# EAGLE schematic cpu (EAGLE 4.15), part 1 of 2

## Sheet 1 of 16
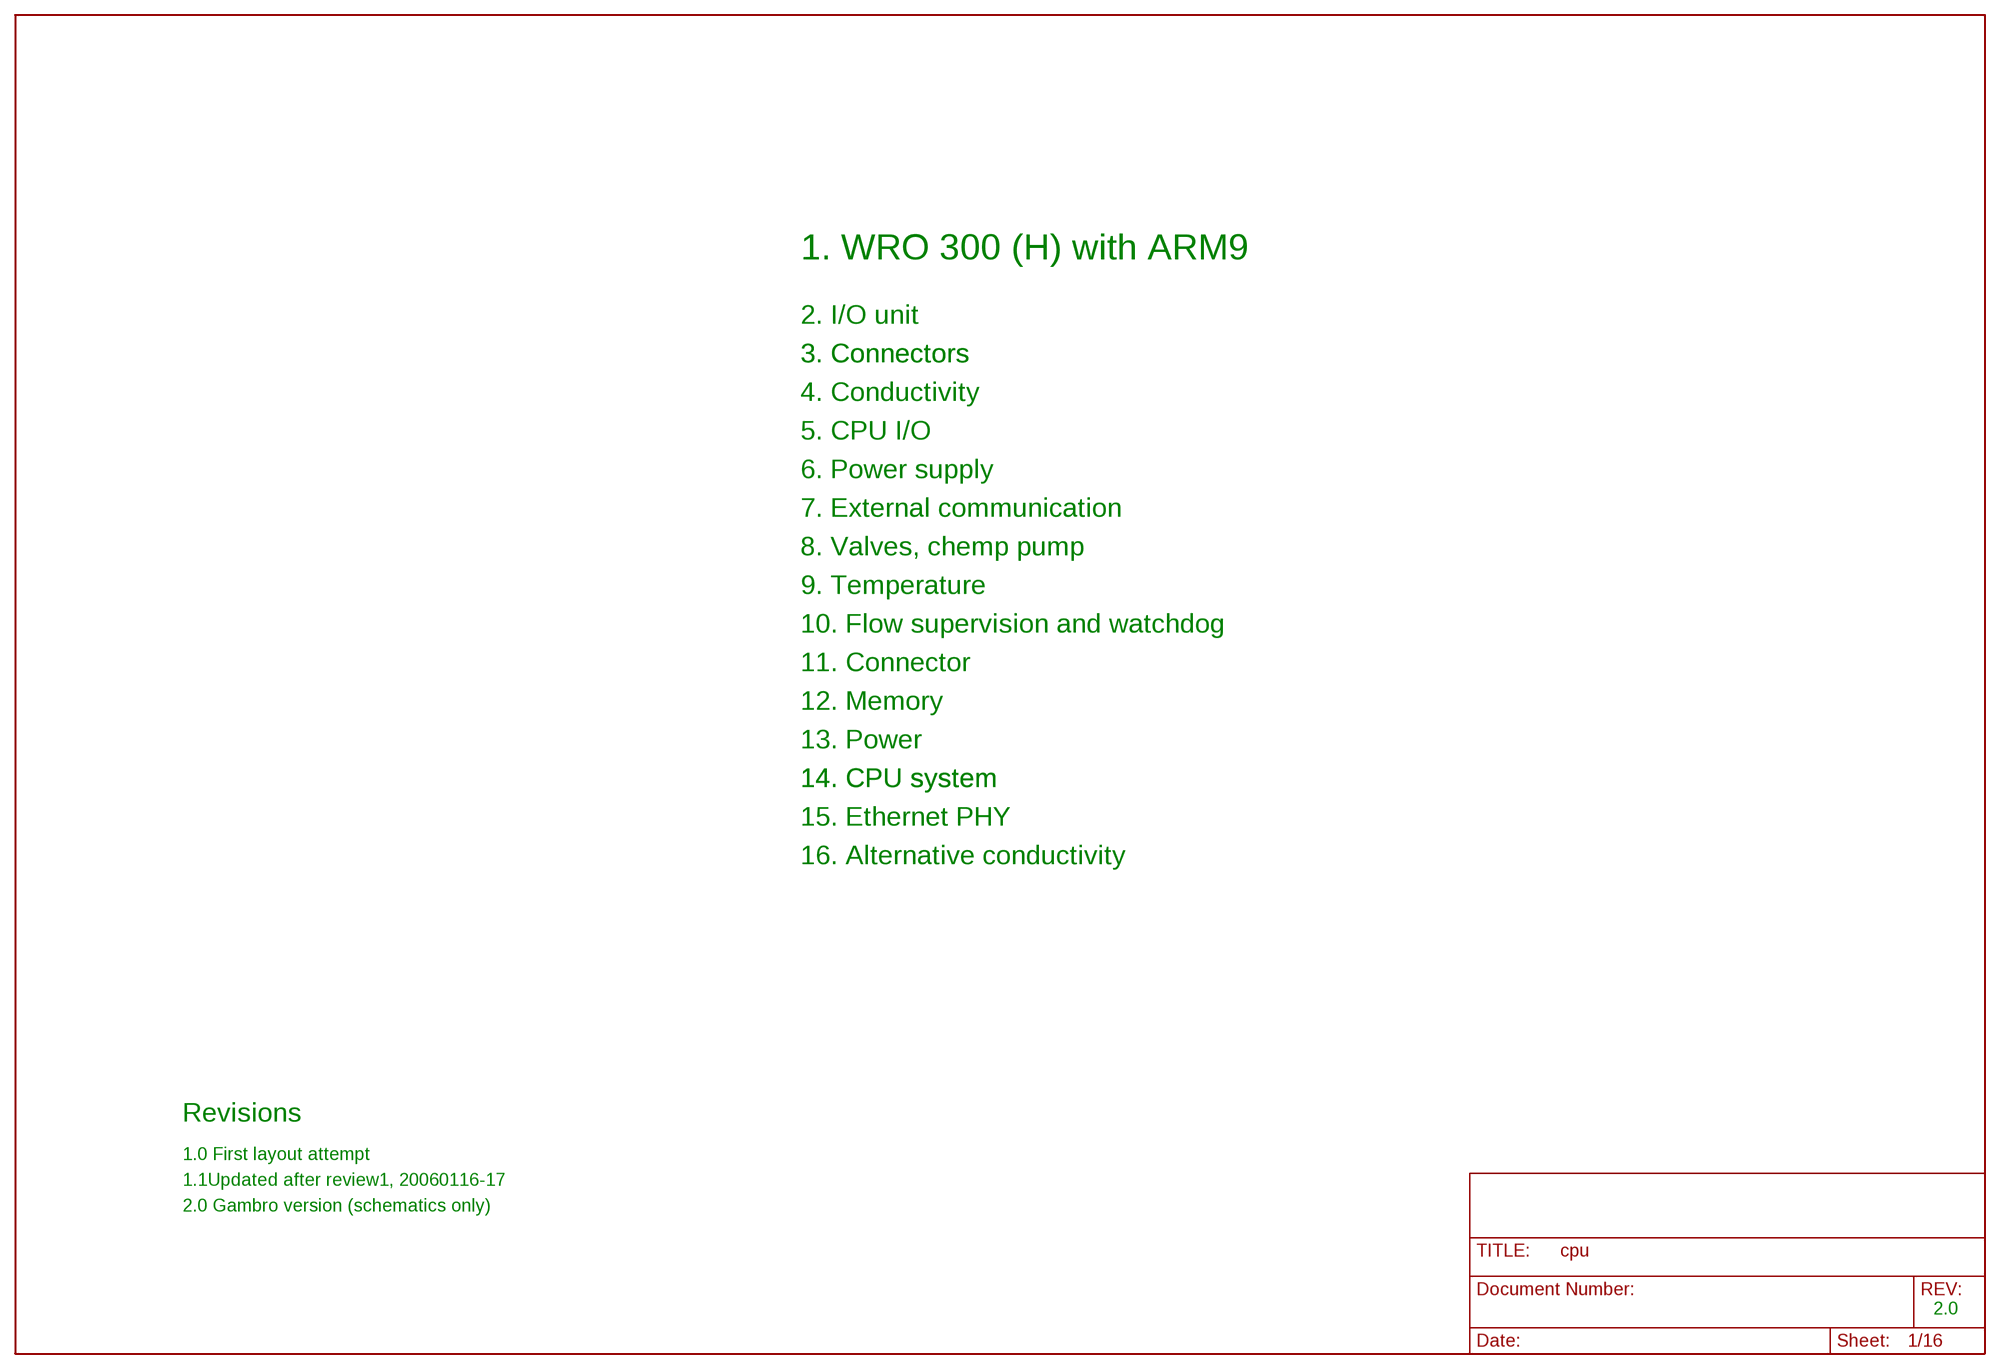
[diagram p0: schematic, sheet 1]

### Notes on the sheet
- 1. WRO 300 (H) with ARM9
- 2. I/O unit
- 3. Connectors | 3. Connectors
- 4. Conductivity
- 5. CPU I/O
- 6. Power supply
- 7. External communication
- 8. Valves, chemp pump
- 9. Temperature
- 10. Flow supervision and watchdog
- 11. Connector
- 12. Memory
- 13. Power
- 14. CPU system | 14. CPU system
- 15. Ethernet PHY
- 16. Alternative conductivity
- Revisions
- 1.0 First layout attempt
- 1.1Updated after review1, 20060116-17
- 2.0 Gambro version (schematics only)
- 2.0

## Sheet 2 of 16
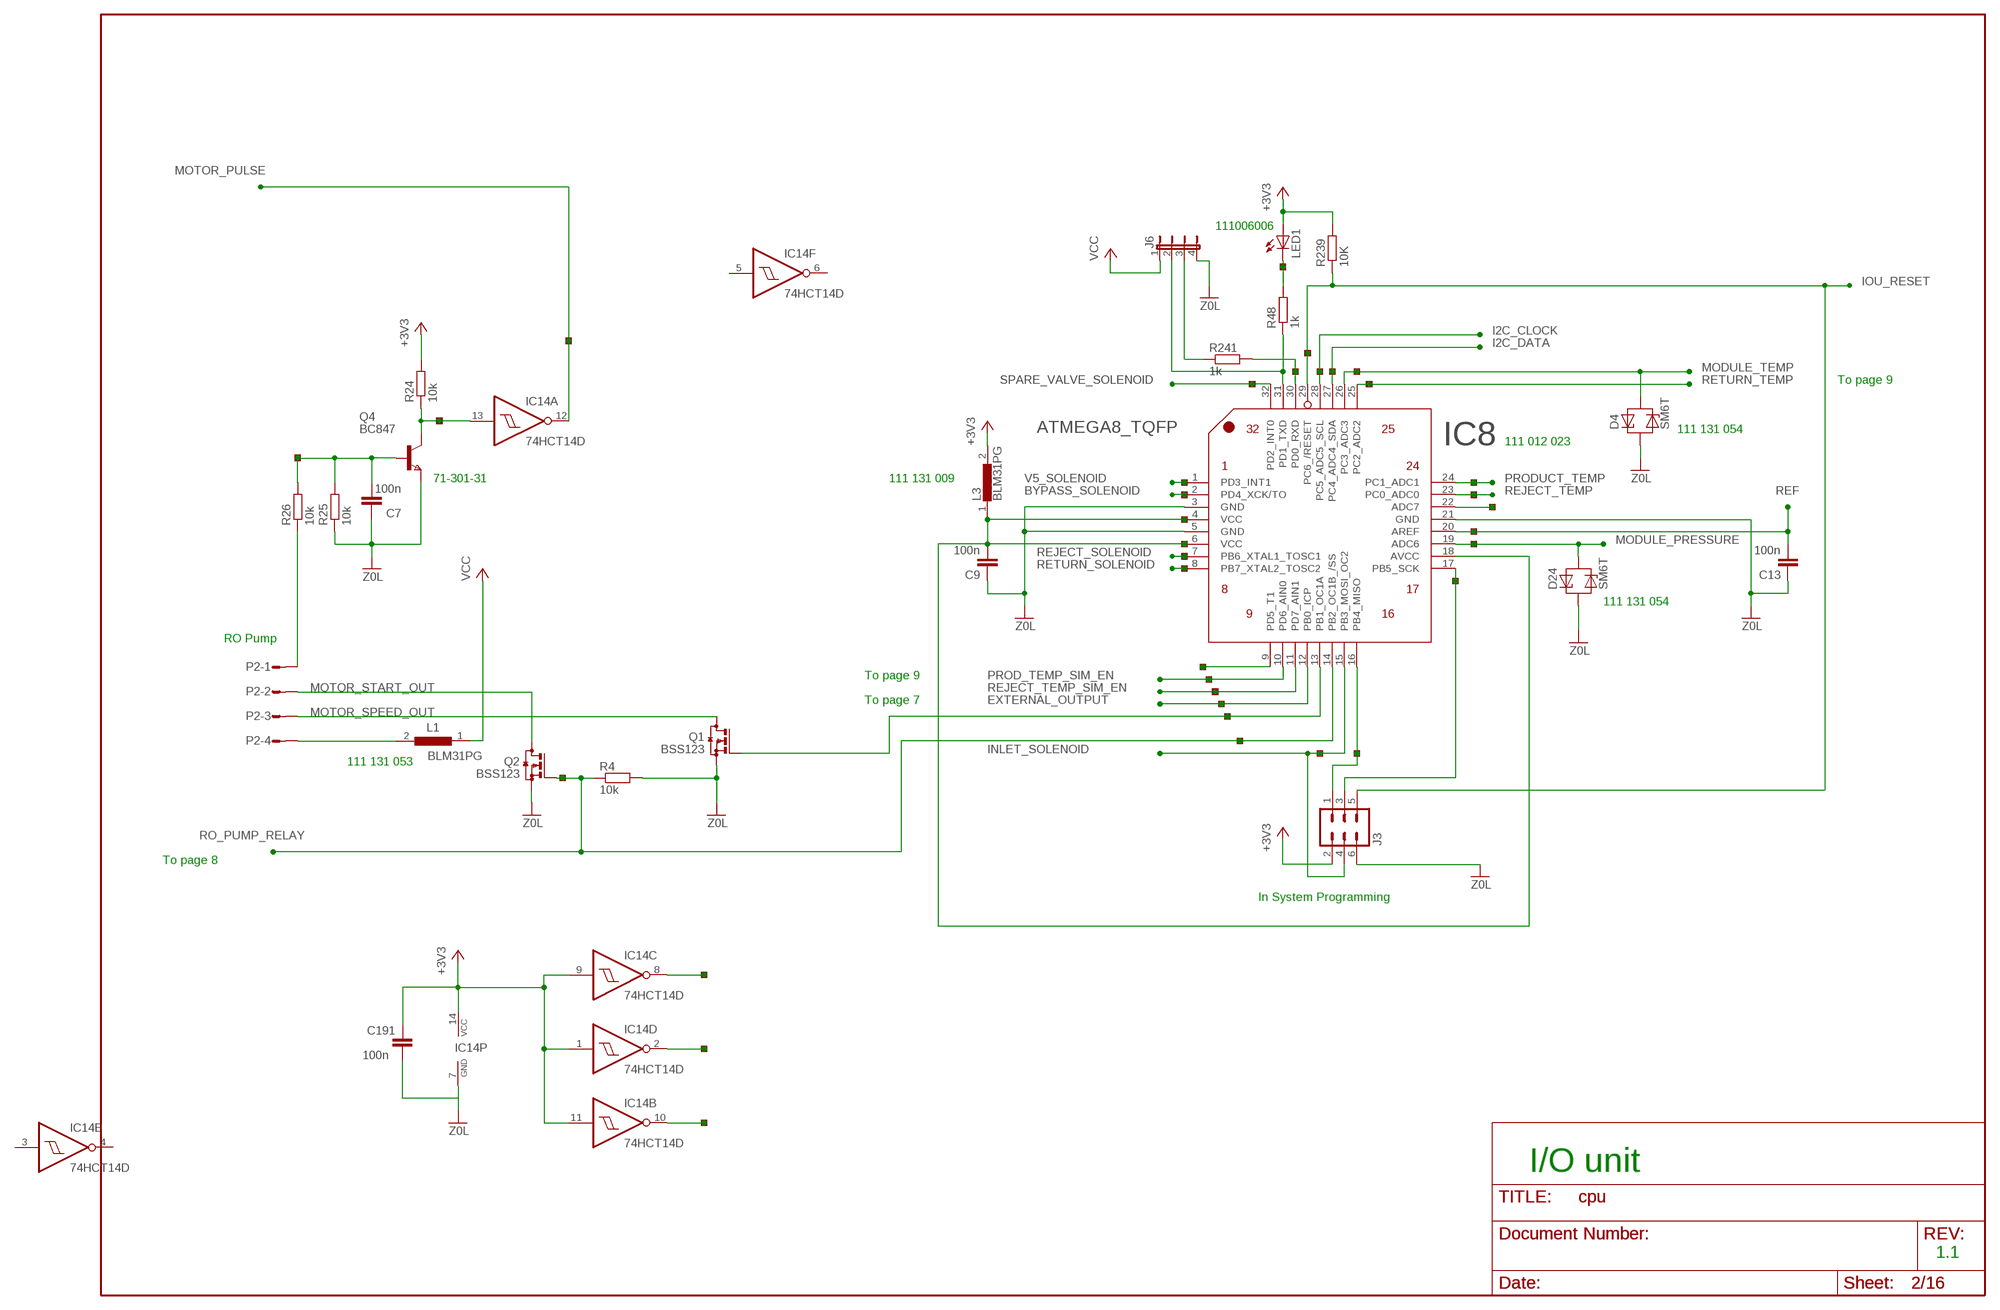
[diagram p1: schematic, sheet 2]

### Parts
C7  100n  C-EUC0805K  [C0805K]
C9  100n  C-EUC0805K  [C0805K]
C13  100n  C-EUC0805K  [C0805K]
C191  100n  C-EUC0805K  [C0805K]
D4  SM6T  [SMB]
D24  SM6T  [SMB]
IC8  ATMEGA8_TQFP  [TQFP-32]
IC14  74HCT14D  [SO14]
J3  MA03-2  [MA03-2]
J6  JP4E  [JP4]
L1  BLM31PG  L1210  [L-0603]
L3  BLM31PG  L1210  [L-0603]
LED1  LEDCHIPLED_1206  [CHIPLED_1206]
P2  L04P  [L04P]
Q1  BSS123  [SOT23]
Q2  BSS123  [SOT23]
Q4  BC847  NPNSOT23  [SOT-23]
R4  10k  R-EU_R0805W  [R0805W]
R24  10k  R-EU_R0805W  [R0805W]
R25  10k  R-EU_R0805W  [R0805W]
R26  10k  R-EU_R0805W  [R0805W]
R48  1k  R-EU_R0805W  [R0805W]
R239  10K  R-EU_R0805W  [R0805W]
R241  1k  R-EU_R0805W  [R0805W]
U$10  TESTPAD  [TESTPAD]
U$13  TESTPAD  [TESTPAD]
U$21  TESTPAD  [TESTPAD]
U$22  TESTPAD  [TESTPAD]
U$23  TESTPAD  [TESTPAD]
U$25  TESTPAD  [TESTPAD]
U$30  TESTPAD  [TESTPAD]
U$31  TESTPAD  [TESTPAD]
U$37  TESTPAD  [TESTPAD]
U$40  TESTPAD  [TESTPAD]
U$49  TESTPAD  [TESTPAD]
U$50  TESTPAD  [TESTPAD]
U$51  TESTPAD  [TESTPAD]
U$52  TESTPAD  [TESTPAD]
U$54  TESTPAD  [TESTPAD]
U$55  TESTPAD  [TESTPAD]
U$57  TESTPAD  [TESTPAD]
U$60  TESTPAD  [TESTPAD]
U$64  TESTPAD  [TESTPAD]
U$65  TESTPAD  [TESTPAD]
U$68  TESTPAD  [TESTPAD]
U$69  TESTPAD  [TESTPAD]
U$73  TESTPAD  [TESTPAD]
U$74  TESTPAD  [TESTPAD]
U$75  TESTPAD  [TESTPAD]
U$76  TESTPAD  [TESTPAD]
U$82  TESTPAD  [TESTPAD]
U$83  TESTPAD  [TESTPAD]
U$84  TESTPAD  [TESTPAD]
U$168  TESTPAD  [TESTPAD]
U$230  TESTPAD  [TESTPAD]
U$231  TESTPAD  [TESTPAD]
U$232  TESTPAD  [TESTPAD]
U$544  TESTPAD  [TESTPAD]
U$545  TESTPAD  [TESTPAD]

### Nets
0V: C7.1 C9.1 C13.1 C191.1 D4.A D24.A IC8.3(GND) IC8.5(GND) IC8.21(GND) IC14.7(P:GND) J3.6 J6.4 Q1.2(S) Q2.2(S) Q4.2(E) R4.2 R25.1 ; supply symbol labelled Z0L ; also sheet 3,4,5,6,7,8,9,10,11,12,13,14,15,16
+3V3: C191.2 IC14.1(D:I) IC14.9(C:I) IC14.11(B:I) IC14.14(P:VCC) J3.2 L3.2 LED1.A R24.2 R239.2 ; also sheet 3,4,5,6,7,10,11,12,13,14,15,16
BYPASS_SOLENOID: IC8.2(PD4_XCK/TO) U$60.1 ; also sheet 8
EXTERNAL_OUTPUT: IC8.12(PB0_ICP) U$52.1 ; also sheet 7
I2C_CLOCK: IC8.28(PC5_ADC5_SCL) U$22.1 ; also sheet 3,5,10
I2C_DATA: IC8.27(PC4_ADC4_SDA) U$23.1 ; also sheet 3,5,10
INLET_SOLENOID: IC8.15(PB3_MOSI_OC2) J3.4 U$544.1 ; also sheet 8
IOU_RESET: IC8.29(PC6_/RESET) J3.5 R239.1 U$84.1 ; also sheet 10
MODULE_PRESSURE: D24.C IC8.19(ADC6) U$83.1 ; also sheet 11
MODULE_TEMP: D4.C IC8.26(PC3_ADC3) U$25.1 ; also sheet 11
MOTOR_PULSE: IC14.12(A:O) U$230.1 ; also sheet 4
MOTOR_SPEED_OUT: P2.3 Q1.3(D)
MOTOR_START_OUT: P2.2 Q2.3(D)
N$8: P2.1 R26.1
N$35: IC8.22(ADC7) U$40.1
N$40: IC8.9(PD5_T1) U$49.1
N$76: IC14.10(B:O) U$76.1
N$84: C7.2 Q4.3(B) R25.2 R26.2 U$232.1
N$92: L1.2 P2.4
N$101: C9.2 IC8.4(VCC) IC8.6(VCC) IC8.18(AVCC) L3.1 U$64.1 U$65.1
N$102: LED1.C R48.2 U$545.1
N$104: IC8.17(PB5_SCK) J3.3 U$55.1
N$105: IC8.16(PB4_MISO) J3.1 U$57.1
N$106: J6.3 R241.1
N$107: IC8.31(PD1_TXD) J6.2 R48.1
N$124: IC14.2(D:O) U$75.1
N$128: IC14.13(A:I) Q4.1(C) R24.1 U$231.1
N$134: IC14.8(C:O) U$73.1
N$381: IC8.30(PD0_RXD) R241.2 U$21.1
PROD_TEMP_SIM_EN: IC8.10(PD6_AIN0) U$50.1 ; also sheet 9
PRODUCT_TEMP: IC8.24(PC1_ADC1) U$31.1 ; also sheet 9
REF: C13.2 IC8.20(AREF) U$82.1 ; also sheet 6,9
REJECT_SOLENOID: IC8.7(PB6_XTAL1_TOSC1) U$68.1 ; also sheet 8
REJECT_TEMP: IC8.23(PC0_ADC0) U$37.1 ; also sheet 9
REJECT_TEMP_SIM_EN: IC8.11(PD7_AIN1) U$51.1 ; also sheet 9
RETURN_SOLENOID: IC8.8(PB7_XTAL2_TOSC2) U$69.1 ; also sheet 8
RETURN_TEMP: IC8.25(PC2_ADC2) U$30.1 ; also sheet 9
RO_PUMP_RELAY: IC8.14(PB2_OC1B_/SS) Q2.1(G) R4.1 U$74.1 U$168.1 ; also sheet 8
SPARE_VALVE_SOLENOID: IC8.32(PD2_INT0) U$13.1 ; also sheet 8
V5_SOLENOID: IC8.1(PD3_INT1) U$10.1 ; also sheet 8
VCC: J6.1 L1.1 ; also sheet 3,6,7,10,11
XXD: IC8.13(PB1_OC1A) Q1.1(G) U$54.1

### Notes on the sheet
- 111006006
- To page 9
- 111 131 054
- 111 012 023
- 71-301-31 | 111 131 009
- 111 131 054
- RO Pump
- To page 9
- To page 7
- 111 131 053
- To page 8
- In System Programming
- I/O unit
- 1.1

## Sheet 3 of 16
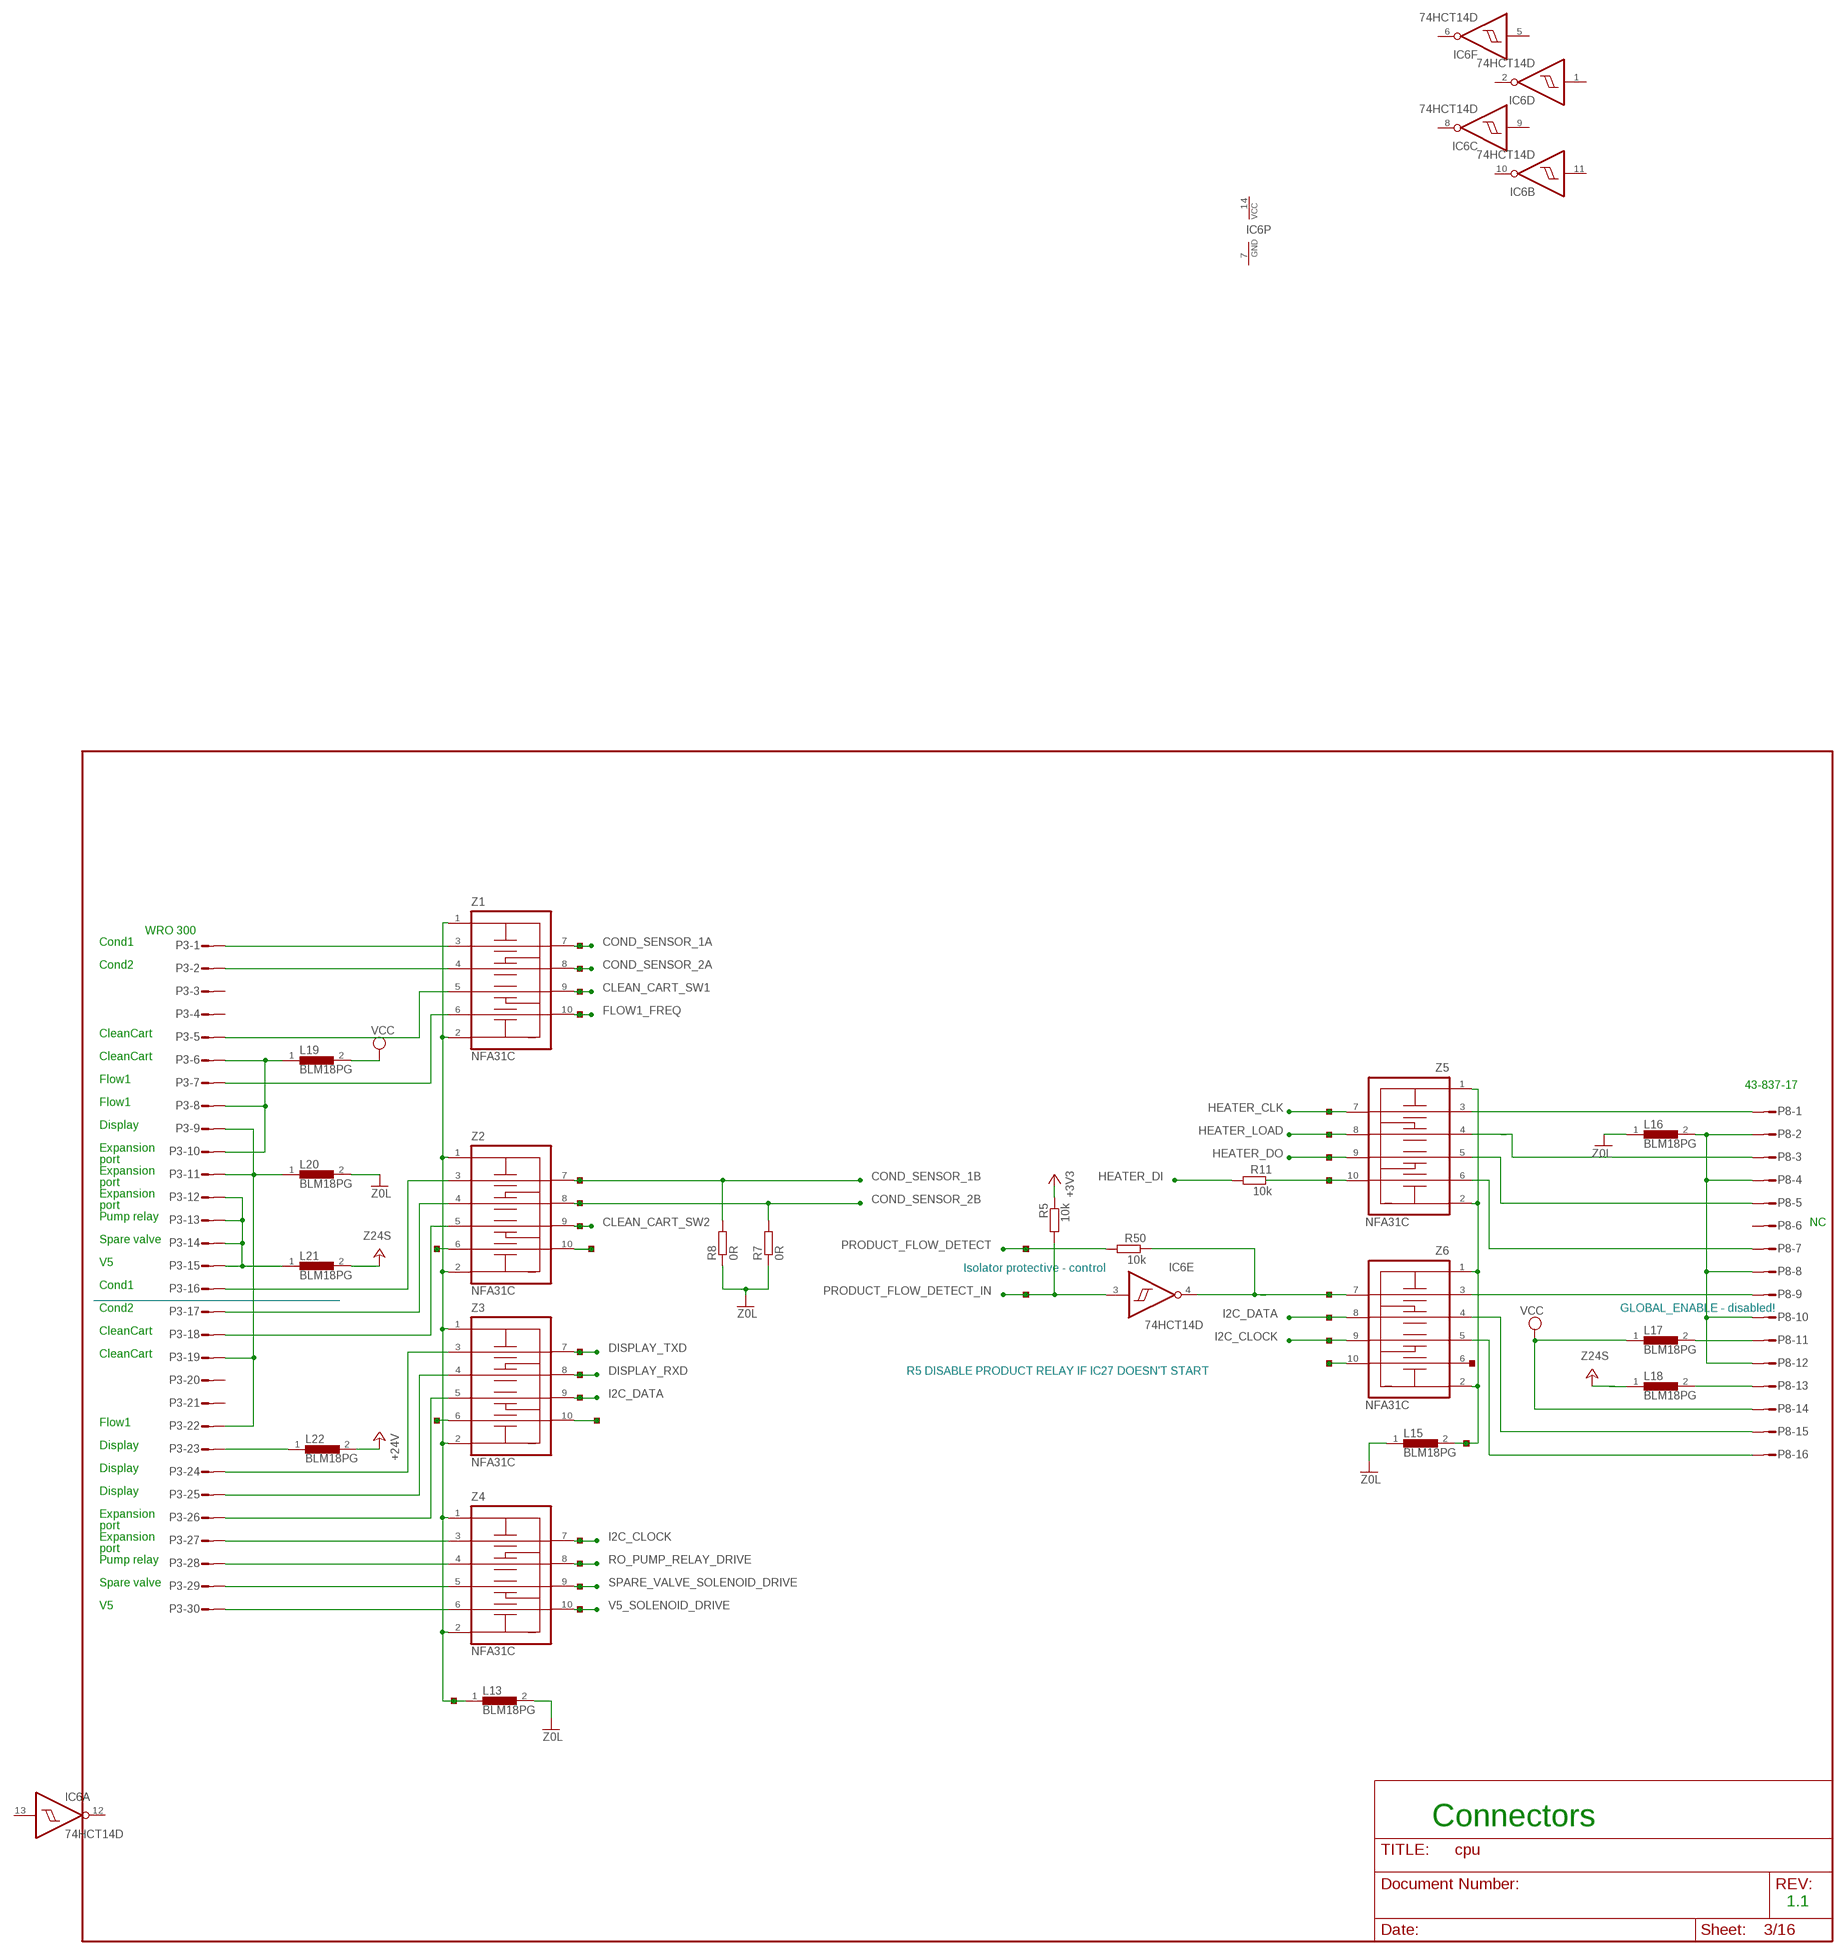
[diagram p2: schematic, sheet 3]

### Parts
IC6  74HCT14D  [SO14]
L13  BLM18PG  [L-0603]
L15  BLM18PG  [L-0603]
L16  BLM18PG  [L-0603]
L17  BLM18PG  [L-0603]
L18  BLM18PG  [L-0603]
L19  BLM18PG  [L-0603]
L20  BLM18PG  [L-0603]
L21  BLM18PG  [L-0603]
L22  BLM18PG  [L-0603]
P3  MODU30  [MODU30]
P8  MODU16  [MODU16]
R5  10k  R-EU_R0805W  [R0805W]
R7  0R  R-EU_R0805W  [R0805W]
R8  0R  R-EU_R0805W  [R0805W]
R11  10k  R-EU_R0805W  [R0805W]
R50  10k  R-EU_R0805W  [R0805W]
U$80  TESTPAD  [TESTPAD]
U$140  TESTPAD  [TESTPAD]
U$141  TESTPAD  [TESTPAD]
U$142  TESTPAD  [TESTPAD]
U$143  TESTPAD  [TESTPAD]
U$164  TESTPAD  [TESTPAD]
U$165  TESTPAD  [TESTPAD]
U$166  TESTPAD  [TESTPAD]
U$167  TESTPAD  [TESTPAD]
U$180  TESTPAD  [TESTPAD]
U$197  TESTPAD  [TESTPAD]
U$198  TESTPAD  [TESTPAD]
U$199  TESTPAD  [TESTPAD]
U$200  TESTPAD  [TESTPAD]
U$201  TESTPAD  [TESTPAD]
U$202  TESTPAD  [TESTPAD]
U$203  TESTPAD  [TESTPAD]
U$204  TESTPAD  [TESTPAD]
U$205  TESTPAD  [TESTPAD]
U$206  TESTPAD  [TESTPAD]
U$207  TESTPAD  [TESTPAD]
U$208  TESTPAD  [TESTPAD]
U$209  TESTPAD  [TESTPAD]
U$210  TESTPAD  [TESTPAD]
U$211  TESTPAD  [TESTPAD]
U$212  TESTPAD  [TESTPAD]
U$215  TESTPAD  [TESTPAD]
U$227  TESTPAD  [TESTPAD]
U$527  TESTPAD  [TESTPAD]
U$528  TESTPAD  [TESTPAD]
U$529  TESTPAD  [TESTPAD]
Z1  NFA31C  EMI_FILTER_22PF/200-MA  [EMI_FILTER_1206]
Z2  NFA31C  EMI_FILTER_22PF/200-MA  [EMI_FILTER_1206]
Z3  NFA31C  EMI_FILTER_22PF/200-MA  [EMI_FILTER_1206]
Z4  NFA31C  EMI_FILTER_22PF/200-MA  [EMI_FILTER_1206]
Z5  NFA31C  EMI_FILTER_22PF/200-MA  [EMI_FILTER_1206]
Z6  NFA31C  EMI_FILTER_22PF/200-MA  [EMI_FILTER_1206]

### Nets
0V: L13.2 L15.1 L16.1 L20.2 R7.1 R8.1 ; supply symbol labelled Z0L ; also sheet 2,4,5,6,7,8,9,10,11,12,13,14,15,16
+3V3: R5.1 ; also sheet 2,4,5,6,7,10,11,12,13,14,15,16
+24S: L18.1 L21.2 ; supply symbol labelled Z24S ; also sheet 6,8,9,11
+24V: L22.2 ; also sheet 6,7,8
CLEAN_CART_SW1: U$528.1 Z1.9 ; also sheet 5
CLEAN_CART_SW2: U$197.1 Z2.9 ; also sheet 5
COND_SENSOR_1A: U$80.1 Z1.7 ; also sheet 4,16
COND_SENSOR_1B: P3.16 R8.2 U$199.1 Z2.3 Z2.7 ; also sheet 16
COND_SENSOR_2A: U$527.1 Z1.8 ; also sheet 4,16
COND_SENSOR_2B: P3.17 R7.2 U$198.1 Z2.4 Z2.8 ; also sheet 16
DISPLAY_RXD: U$200.1 Z3.8 ; also sheet 5
DISPLAY_TXD: P3.24 U$167.1 Z3.3 Z3.7 ; also sheet 5
FLOW1_FREQ: U$529.1 Z1.10 ; also sheet 4
HEATER_CLK: U$207.1 Z5.7 ; also sheet 5
HEATER_DI: R11.1 R11.2 ; also sheet 5
HEATER_DO: P8.P$5 U$205.1 Z5.5 Z5.9 ; also sheet 5
HEATER_LOAD: U$206.1 Z5.8 ; also sheet 5
I2C_CLOCK: U$140.1 U$209.1 Z4.7 Z6.9 ; also sheet 2,5,10
I2C_DATA: U$201.1 U$210.1 Z3.9 Z6.8 ; also sheet 2,5,10
N$98: U$204.1 Z5.10
N$103: L15.2 U$215.1 Z5.1 Z5.2 Z6.1 Z6.2
N$157: P8.P$1 Z5.3
N$163: P8.P$3 Z5.4
N$164: P8.P$13 Z6.3
N$165: P8.P$19 Z6.4
N$166: P8.P$20 Z6.5
N$180: P8.P$7 Z5.6
N$181: P3.1 Z1.3
N$182: P3.2 Z1.4
N$183: P3.5 Z1.5
N$184: P3.7 Z1.6
N$185: L13.1 U$180.1 Z1.1 Z1.2 Z2.1 Z2.2 Z3.1 Z3.2 Z4.1 Z4.2
N$186: P3.18 Z2.5
N$187: P3.25 Z3.4
N$188: P3.26 Z3.5
N$189: P3.27 Z4.3
N$190: P3.28 Z4.4
N$191: P3.29 Z4.5
N$192: P3.30 Z4.6
N$193: L18.2 P8.P$17
N$194: L17.2 P8.P$15
N$195: L22.1 P3.23
N$196: L19.1 P3.6 P3.8 P3.10
N$197: L21.1 P3.12 P3.13 P3.14 P3.15
N$198: L16.2 P8.P$2 P8.P$4 P8.P$8 P8.P$14 P8.P$16
N$199: L20.1 P3.9 P3.11 P3.19 P3.22
N$302: U$165.1 Z2.10
N$303: U$202.1 Z3.10
N$304: U$208.1 Z6.10
N$341: U$164.1 Z3.6
N$356: U$166.1 Z2.6
N$375: U$212.1 Z6.6
PRODUCT_FLOW_DETECT: R50.2 U$203.1 ; also sheet 5
PRODUCT_FLOW_DETECT_IN: IC6.3(E:I) R5.2 U$227.1 ; also sheet 10
RO_PUMP_RELAY_DRIVE: U$141.1 Z4.8 ; also sheet 8
SPARE_VALVE_SOLENOID_DRIVE: U$142.1 Z4.9 ; also sheet 8
V5_SOLENOID_DRIVE: U$143.1 Z4.10 ; also sheet 8
VCC: L17.1 L19.2 P8.P$18 ; also sheet 2,6,7,10,11
XXB: IC6.4(E:O) R50.1 U$211.1 Z6.7
Unconnected: P3.3 P3.4 P3.20 P3.21 P8.P$6

### Notes on the sheet
- WRO 300
- Cond1
- Cond2
- CleanCart
- CleanCart
- Flow1
- 43-837-17
- Flow1
- Display
- Expansion
- port
- Expansion
- port
- Expansion
- port
- Pump relay
- NC
- Spare valve
- V5
- Isolator protective - control
- Cond1
- Cond2 | GLOBAL_ENABLE - disabled!
- CleanCart
- CleanCart
- R5 DISABLE PRODUCT RELAY IF IC27 DOESN'T START
- Flow1
- Display
- Display
- Display
- Expansion
- port
- Expansion
- port
- Pump relay
- Spare valve
- V5
- Expansion connector w i2c, power and A/D? | Connectors
- 1.1

## Sheet 4 of 16
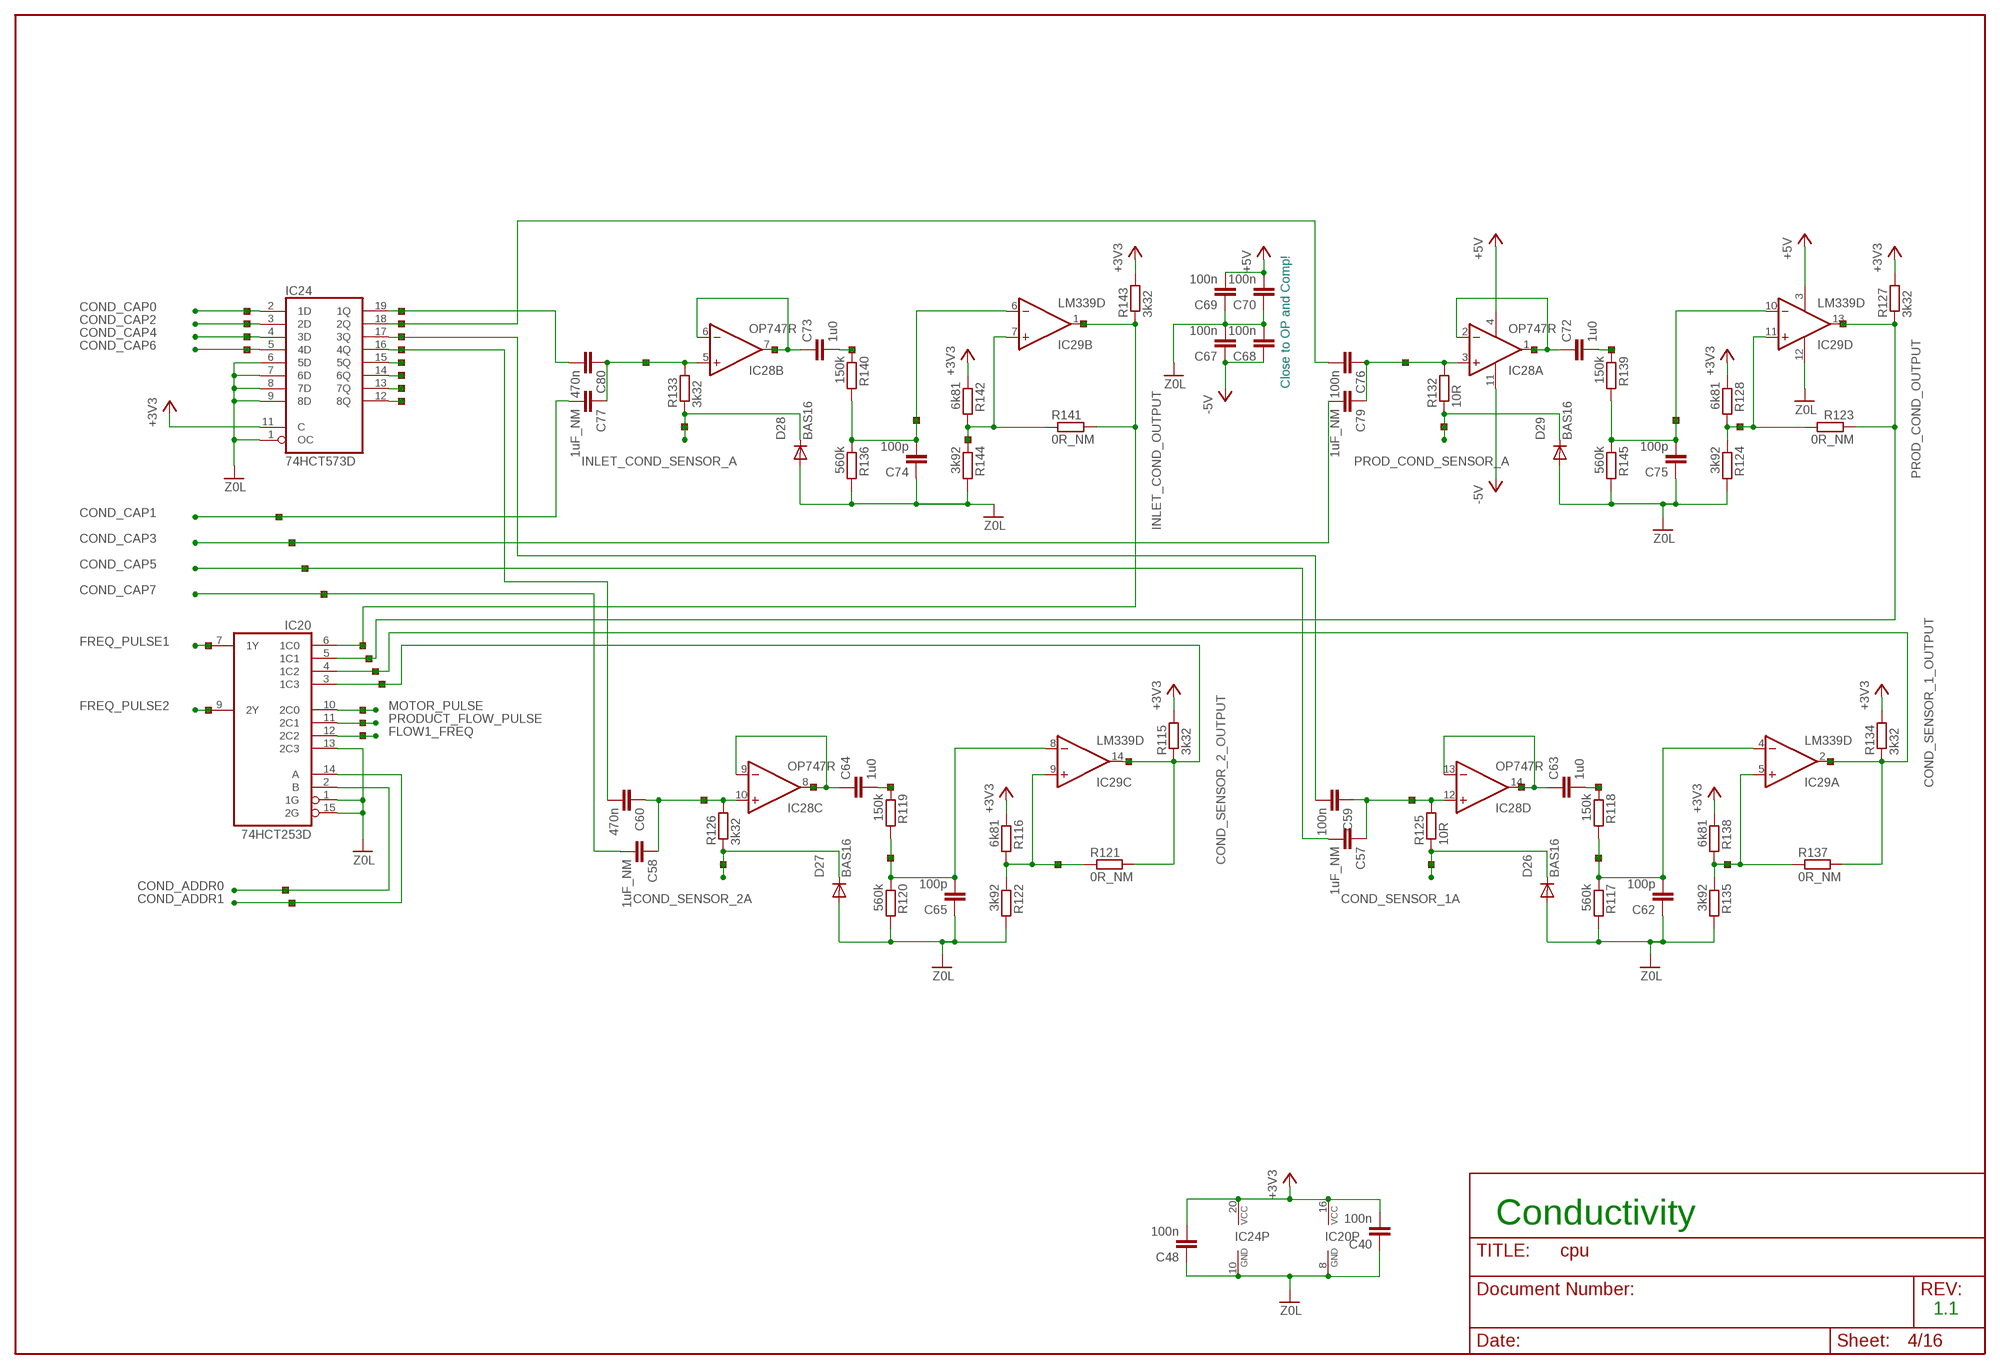
[diagram p3: schematic, sheet 4]

### Parts
C40  100n  C-EUC0805K  [C0805K]
C48  100n  C-EUC0805K  [C0805K]
C57  1uF_NM  C-EUC0805K  [C0805K]
C58  1uF_NM  C-EUC0805K  [C0805K]
C59  100n  C-EUC0805K  [C0805K]
C60  470n  C-EUC0805K  [C0805K]
C62  100p  C-EUC0805K  [C0805K]
C63  1u0  C-EUC0805K  [C0805K]
C64  1u0  C-EUC0805K  [C0805K]
C65  100p  C-EUC0805K  [C0805K]
C67  100n  C-EUC0805K  [C0805K]
C68  100n  C-EUC0805K  [C0805K]
C69  100n  C-EUC0805K  [C0805K]
C70  100n  C-EUC0805K  [C0805K]
C72  1u0  C-EUC0805K  [C0805K]
C73  1u0  C-EUC0805K  [C0805K]
C74  100p  C-EUC0805K  [C0805K]
C75  100p  C-EUC0805K  [C0805K]
C76  100n  C-EUC0805K  [C0805K]
C77  1uF_NM  C-EUC0805K  [C0805K]
C79  1uF_NM  C-EUC0805K  [C0805K]
C80  470n  C-EUC0805K  [C0805K]
D26  BAS16  [SOT23]
D27  BAS16  [SOT23]
D28  BAS16  [SOT23]
D29  BAS16  [SOT23]
IC20  74HCT253D  [SO16]
IC24  74HCT573D  [SO20W]
IC28  OP747R  LF347D  [SO14]
IC29  LM339D  [SO14]
R115  3k32  R-EU_R0805W  [R0805W]
R116  6k81  R-EU_R0805W  [R0805W]
R117  560k  R-EU_R0805W  [R0805W]
R118  150k  R-EU_R0805W  [R0805W]
R119  150k  R-EU_R0805W  [R0805W]
R120  560k  R-EU_R0805W  [R0805W]
R121  0R_NM  R-EU_R0805W  [R0805W]
R122  3k92  R-EU_R0805W  [R0805W]
R123  0R_NM  R-EU_R0805W  [R0805W]
R124  3k92  R-EU_R0805W  [R0805W]
R125  10R  R-EU_R0805W  [R0805W]
R126  3k32  R-EU_R0805W  [R0805W]
R127  3k32  R-EU_R0805W  [R0805W]
R128  6k81  R-EU_R0805W  [R0805W]
R132  10R  R-EU_R0805W  [R0805W]
R133  3k32  R-EU_R0805W  [R0805W]
R134  3k32  R-EU_R0805W  [R0805W]
R135  3k92  R-EU_R0805W  [R0805W]
R136  560k  R-EU_R0805W  [R0805W]
R137  0R_NM  R-EU_R0805W  [R0805W]
R138  6k81  R-EU_R0805W  [R0805W]
R139  150k  R-EU_R0805W  [R0805W]
R140  150k  R-EU_R0805W  [R0805W]
R141  0R_NM  R-EU_R0805W  [R0805W]
R142  6k81  R-EU_R0805W  [R0805W]
R143  3k32  R-EU_R0805W  [R0805W]
R144  3k92  R-EU_R0805W  [R0805W]
R145  560k  R-EU_R0805W  [R0805W]
U$145  TESTPAD  [TESTPAD]
U$146  TESTPAD  [TESTPAD]
U$147  TESTPAD  [TESTPAD]
U$148  TESTPAD  [TESTPAD]
U$150  TESTPAD  [TESTPAD]
U$151  TESTPAD  [TESTPAD]
U$152  TESTPAD  [TESTPAD]
U$153  TESTPAD  [TESTPAD]
U$154  TESTPAD  [TESTPAD]
U$155  TESTPAD  [TESTPAD]
U$156  TESTPAD  [TESTPAD]
U$157  TESTPAD  [TESTPAD]
U$158  TESTPAD  [TESTPAD]
U$159  TESTPAD  [TESTPAD]
U$160  TESTPAD  [TESTPAD]
U$161  TESTPAD  [TESTPAD]
U$163  TESTPAD  [TESTPAD]
U$172  TESTPAD  [TESTPAD]
U$173  TESTPAD  [TESTPAD]
U$174  TESTPAD  [TESTPAD]
U$175  TESTPAD  [TESTPAD]
U$176  TESTPAD  [TESTPAD]
U$177  TESTPAD  [TESTPAD]
U$178  TESTPAD  [TESTPAD]
U$179  TESTPAD  [TESTPAD]
U$185  TESTPAD  [TESTPAD]
U$186  TESTPAD  [TESTPAD]
U$187  TESTPAD  [TESTPAD]
U$188  TESTPAD  [TESTPAD]
U$189  TESTPAD  [TESTPAD]
U$190  TESTPAD  [TESTPAD]
U$194  TESTPAD  [TESTPAD]
U$195  TESTPAD  [TESTPAD]
U$196  TESTPAD  [TESTPAD]
U$213  TESTPAD  [TESTPAD]
U$214  TESTPAD  [TESTPAD]
U$216  TESTPAD  [TESTPAD]
U$217  TESTPAD  [TESTPAD]
U$218  TESTPAD  [TESTPAD]
U$219  TESTPAD  [TESTPAD]
U$220  TESTPAD  [TESTPAD]
U$221  TESTPAD  [TESTPAD]
U$222  TESTPAD  [TESTPAD]
U$223  TESTPAD  [TESTPAD]
U$224  TESTPAD  [TESTPAD]
U$234  TESTPAD  [TESTPAD]
U$530  TESTPAD  [TESTPAD]
U$546  TESTPAD  [TESTPAD]
U$547  TESTPAD  [TESTPAD]
U$548  TESTPAD  [TESTPAD]
U$549  TESTPAD  [TESTPAD]
U$550  TESTPAD  [TESTPAD]
U$551  TESTPAD  [TESTPAD]
U$552  TESTPAD  [TESTPAD]
U$553  TESTPAD  [TESTPAD]

### Nets
0V: C40.1 C48.1 C62.1 C65.1 C67.2 C68.2 C69.1 C70.1 C74.1 C75.1 D26.1(A) D27.1(A) D28.1(A) D29.1(A) IC20.1(1G) IC20.8(GND) IC20.13(2C3) IC20.15(2G) IC24.1(OC) IC24.6(5D) IC24.7(6D) IC24.8(7D) IC24.9(8D) IC24.10(GND) IC29.12(P:GND) R117.2 R120.2 R122.2 R124.2 R135.2 R136.2 R144.2 R145.2 ; supply symbol labelled Z0L ; also sheet 2,3,5,6,7,8,9,10,11,12,13,14,15,16
+3V3: C40.2 C48.2 IC20.16(VCC) IC24.11(C) IC24.20(VCC) R115.2 R116.1 R127.2 R128.1 R134.2 R138.1 R142.1 R143.2 ; also sheet 2,3,5,6,7,10,11,12,13,14,15,16
+5V: C69.2 C70.2 IC28.4(P:V+) IC29.3(P:V+) ; also sheet 6,9
-5V: C67.1 C68.1 IC28.11(P:V-) ; also sheet 6,9
COND_ADDR0: IC20.2(B) U$214.1
COND_ADDR1: IC20.14(A) U$218.1
COND_CAP0: IC24.2(1D) U$145.1 ; also sheet 5
COND_CAP1: C77.2 U$190.1 ; also sheet 5
COND_CAP2: IC24.3(2D) U$146.1 ; also sheet 5
COND_CAP3: C79.2 U$189.1 ; also sheet 5
COND_CAP4: IC24.4(3D) U$147.1 ; also sheet 5,12
COND_CAP5: C57.2 U$188.1 ; also sheet 5
COND_CAP6: IC24.5(4D) U$148.1 ; also sheet 5
COND_CAP7: C58.2 U$187.1 ; also sheet 5
COND_SENSOR_1_OUTPUT: IC20.4(1C2) IC29.2(A:OUT) R134.1 R137.2 U$178.1 U$551.1 ; also sheet 16
COND_SENSOR_1A: D26.3(C) R125.1 U$217.1 ; also sheet 3,16
COND_SENSOR_2_OUTPUT: IC20.3(1C3) IC29.14(C:OUT) R115.1 R121.2 U$216.1 U$550.1 ; also sheet 16
COND_SENSOR_2A: D27.3(C) R126.1 U$194.1 ; also sheet 3,16
FLOW1_FREQ: IC20.12(2C2) U$547.1 ; also sheet 3
FREQ_PULSE1: IC20.7(1Y) U$186.1 ; also sheet 5
FREQ_PULSE2: IC20.9(2Y) U$185.1 ; also sheet 5
INLET_COND_OUTPUT: IC20.6(1C0) IC29.1(B:OUT) R141.2 R143.1 U$172.1 U$553.1 ; also sheet 16
INLET_COND_SENSOR_A: D28.3(C) R133.1 U$159.1 ; also sheet 11
MOTOR_PULSE: IC20.10(2C0) U$549.1 ; also sheet 2
N$6: C58.1 C60.1 IC28.10(C:+IN) R126.2 U$213.1
N$7: C57.1 C59.1 IC28.12(D:+IN) R125.2 U$219.1
N$10: C63.2 R118.1 U$221.1
N$12: C62.2 IC29.4(A:-IN) R117.1 R118.2 U$224.1
N$15: C80.2 IC24.19(1Q) U$157.1
N$16: C76.2 IC24.18(2Q) U$156.1
N$17: C59.2 IC24.17(3Q) U$155.1
N$18: C60.2 IC24.16(4Q) U$154.1
N$19: C77.1 C80.1 IC28.5(B:+IN) R133.2 U$158.1
N$20: C76.1 C79.1 IC28.3(A:+IN) R132.2 U$173.1
N$25: C72.1 IC28.1(A:OUT) IC28.2(A:-IN) U$175.1
N$27: C64.2 R119.1 U$195.1
N$28: C65.2 IC29.8(C:-IN) R119.2 R120.1 U$546.1
N$30: IC29.5(A:+IN) R135.1 R137.1 R138.2 U$223.1
N$42: C72.2 R139.1 U$176.1
N$43: C75.2 IC29.10(D:-IN) R139.2 R145.1 U$177.1
N$47: IC29.11(D:+IN) R123.1 R124.1 R128.2 U$179.1
N$55: C63.1 IC28.13(D:-IN) IC28.14(D:OUT) U$220.1
N$97: IC29.9(C:+IN) R116.2 R121.1 R122.1 U$222.1
N$132: C64.1 IC28.8(C:OUT) IC28.9(C:-IN) U$196.1
N$136: C73.2 R140.1 U$234.1
N$137: C74.2 IC29.6(B:-IN) R136.1 R140.2 U$161.1
N$138: IC29.7(B:+IN) R141.1 R142.2 R144.1 U$163.1
N$139: C73.1 IC28.6(B:-IN) IC28.7(B:OUT) U$160.1
N$276: IC24.15(5Q) U$153.1
N$277: IC24.14(6Q) U$152.1
N$278: IC24.13(7Q) U$151.1
N$279: IC24.12(8Q) U$150.1
PROD_COND_OUTPUT: IC20.5(1C1) IC29.13(D:OUT) R123.2 R127.1 U$530.1 U$552.1 ; also sheet 16
PROD_COND_SENSOR_A: D29.3(C) R132.1 U$174.1 ; also sheet 11
PRODUCT_FLOW_PULSE: IC20.11(2C1) U$548.1 ; also sheet 11

### Notes on the sheet
- Close to OP and Comp!
- Conductivity
- 1.1

## Sheet 5 of 16
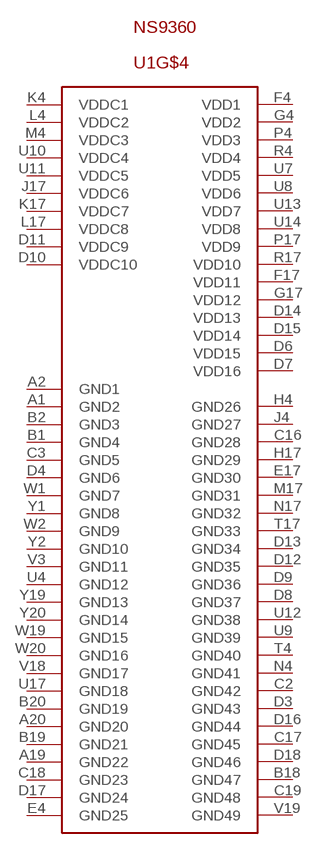
[diagram p4: schematic, sheet 5, part 1 of 2]
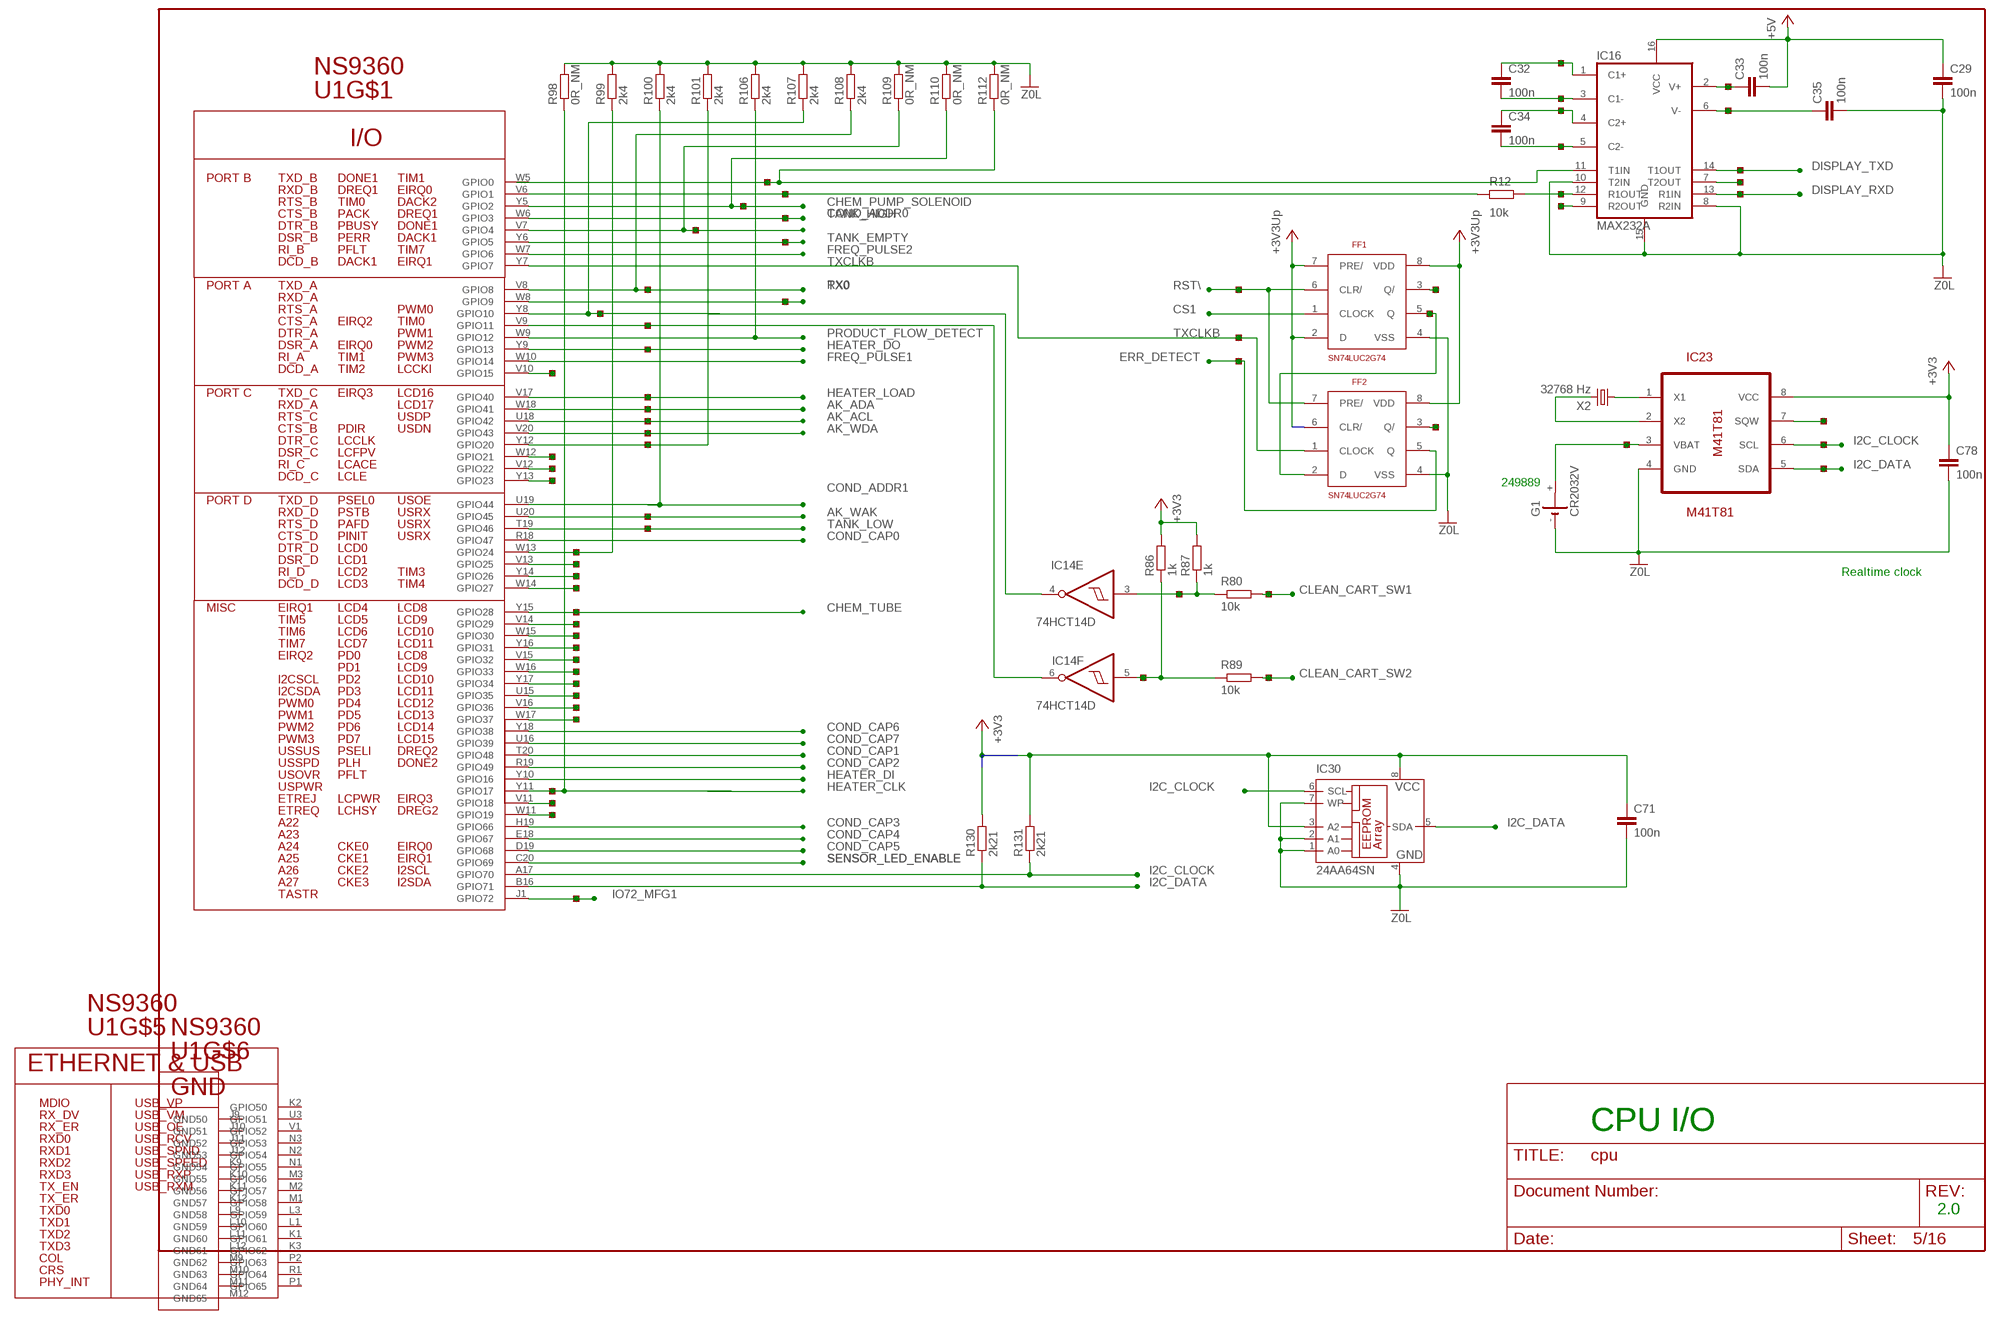
[diagram p5: schematic, sheet 5, part 2 of 2]

### Parts
C29  100n  C-EUC0805K  [C0805K]
C32  100n  C-EUC0805K  [C0805K]
C33  100n  C-EUC0805K  [C0805K]
C34  100n  C-EUC0805K  [C0805K]
C35  100n  C-EUC0805K  [C0805K]
C71  100n  C-EUC0805K  [C0805K]
C78  100n  C-EUC0805K  [C0805K]
FF1  SN74LUC2G74  [LVC2G74]
FF2  SN74LUC2G74  [LVC2G74]
G1  CR2032V  [CR2032V]
IC16  MAX232A  [SO16]
IC23  M41T81  [SO8]
IC30  24AA64SN  [SO-08]
R12  10k  R-EU_R0805W  [R0805W]
R80  10k  R-EU_R0805W  [R0805W]
R86  1k  R-EU_R0805W  [R0805W]
R87  1k  R-EU_R0805W  [R0805W]
R89  10k  R-EU_R0805W  [R0805W]
R98  0R_NM  R-EU_R0805W  [R0805W]
R99  2k4  R-EU_R0805W  [R0805W]
R100  2k4  R-EU_R0805W  [R0805W]
R101  2k4  R-EU_R0805W  [R0805W]
R106  2k4  R-EU_R0805W  [R0805W]
R107  2k4  R-EU_R0805W  [R0805W]
R108  2k4  R-EU_R0805W  [R0805W]
R109  0R_NM  R-EU_R0805W  [R0805W]
R110  0R_NM  R-EU_R0805W  [R0805W]
R112  0R_NM  R-EU_R0805W  [R0805W]
R130  2k21  R-EU_R0805W  [R0805W]
R131  2k21  R-EU_R0805W  [R0805W]
U1  NS9360  [NS9360]
U$181  TESTPAD  [TESTPAD]
U$182  TESTPAD  [TESTPAD]
U$183  TESTPAD  [TESTPAD]
U$184  TESTPAD  [TESTPAD]
U$191  TESTPAD  [TESTPAD]
U$192  TESTPAD  [TESTPAD]
U$193  TESTPAD  [TESTPAD]
U$225  TESTPAD  [TESTPAD]
U$226  TESTPAD  [TESTPAD]
U$228  TESTPAD  [TESTPAD]
U$229  TESTPAD  [TESTPAD]
U$310  TESTPAD  [TESTPAD]
U$311  TESTPAD  [TESTPAD]
U$312  TESTPAD  [TESTPAD]
U$313  TESTPAD  [TESTPAD]
U$314  TESTPAD  [TESTPAD]
U$317  TESTPAD  [TESTPAD]
U$318  TESTPAD  [TESTPAD]
U$331  TESTPAD  [TESTPAD]
U$332  TESTPAD  [TESTPAD]
U$334  TESTPAD  [TESTPAD]
U$335  TESTPAD  [TESTPAD]
U$336  TESTPAD  [TESTPAD]
U$337  TESTPAD  [TESTPAD]
U$338  TESTPAD  [TESTPAD]
U$339  TESTPAD  [TESTPAD]
U$340  TESTPAD  [TESTPAD]
U$341  TESTPAD  [TESTPAD]
U$342  TESTPAD  [TESTPAD]
U$343  TESTPAD  [TESTPAD]
U$344  TESTPAD  [TESTPAD]
U$345  TESTPAD  [TESTPAD]
U$346  TESTPAD  [TESTPAD]
U$347  TESTPAD  [TESTPAD]
U$348  TESTPAD  [TESTPAD]
U$349  TESTPAD  [TESTPAD]
U$350  TESTPAD  [TESTPAD]
U$351  TESTPAD  [TESTPAD]
U$352  TESTPAD  [TESTPAD]
U$353  TESTPAD  [TESTPAD]
U$354  TESTPAD  [TESTPAD]
U$355  TESTPAD  [TESTPAD]
U$356  TESTPAD  [TESTPAD]
U$357  TESTPAD  [TESTPAD]
U$358  TESTPAD  [TESTPAD]
U$359  TESTPAD  [TESTPAD]
U$360  TESTPAD  [TESTPAD]
U$361  TESTPAD  [TESTPAD]
U$364  TESTPAD  [TESTPAD]
U$365  TESTPAD  [TESTPAD]
U$366  TESTPAD  [TESTPAD]
U$367  TESTPAD  [TESTPAD]
U$368  TESTPAD  [TESTPAD]
U$369  TESTPAD  [TESTPAD]
U$370  TESTPAD  [TESTPAD]
U$373  TESTPAD  [TESTPAD]
U$374  TESTPAD  [TESTPAD]
U$375  TESTPAD  [TESTPAD]
U$377  TESTPAD  [TESTPAD]
U$378  TESTPAD  [TESTPAD]
U$381  TESTPAD  [TESTPAD]
U$383  TESTPAD  [TESTPAD]
U$384  TESTPAD  [TESTPAD]
U$394  TESTPAD  [TESTPAD]
U$397  TESTPAD  [TESTPAD]
X2  32768 Hz  CRYTALMM20SS  [MM20SS]

### Nets
0V: C29.2 C35.2 C71.2 C78.2 FF1.4(VSS) FF2.4(VSS) G1.- IC16.8(R2IN) IC16.10(T2IN) IC16.15(GND) IC23.4(GND) IC30.1(A0) IC30.2(A1) IC30.4(GND) IC30.7(WP) R98.2 R99.2 R100.2 R101.2 R106.2 R107.2 R108.2 R109.2 R110.2 R112.2 ; supply symbol labelled Z0L ; also sheet 2,3,4,6,7,8,9,10,11,12,13,14,15,16
+3V3: C29.1 C33.2 C71.1 C78.1 FF1.2(D) FF1.7(PRE/) FF1.8(VDD) FF2.6(CLR/) FF2.8(VDD) IC16.16(VCC) IC23.8(VCC) IC30.3(A2) IC30.8(VCC) R86.2 R87.2 R130.2 R131.2 ; supply symbol labelled +5V, +3V3Up ; also sheet 2,3,4,6,7,10,11,12,13,14,15,16
AK_ACL: U1.U18(GPIO42) U$336.1 ; also sheet 7
AK_ADA: U1.W18(GPIO41) U$337.1 ; also sheet 7
AK_WAK: U1.U20(GPIO45) U$332.1
AK_WDA: U1.V20(GPIO43) U$335.1
CHEM_PUMP_SOLENOID: R110.1 U1.Y5(GPIO2) U$358.1 ; also sheet 8
CHEM_TUBE: U1.Y15(GPIO28) U$347.1 ; also sheet 11
CLEAN_CART_SW1: IC14.4(E:O) R80.2 R107.1 U1.Y8(GPIO10) U$356.1 U$383.1 ; also sheet 3
CLEAN_CART_SW2: IC14.6(F:O) R89.2 U1.V9(GPIO11) U$354.1 U$384.1 ; also sheet 3
COND_ADDR0
: R109.1 U1.V7(GPIO4) U$352.1
COND_ADDR1
: R100.1 U1.U19(GPIO44)
COND_CAP0: U1.R18(GPIO47) ; also sheet 4
COND_CAP1: U1.T20(GPIO48) ; also sheet 4
COND_CAP2: U1.R19(GPIO49) ; also sheet 4
COND_CAP3: U1.H19(GPIO66) ; also sheet 4
COND_CAP4: U1.E18(GPIO67) ; also sheet 4,12
COND_CAP5: U1.D19(GPIO68) ; also sheet 4
COND_CAP6: U1.Y18(GPIO38) ; also sheet 4
COND_CAP7: U1.U16(GPIO39) ; also sheet 4
CS1: FF1.1(CLOCK) ; also sheet 12
DISPLAY_RXD: IC16.13(R1IN) U$228.1 ; also sheet 3
DISPLAY_TXD: IC16.14(T1OUT) U$359.1 ; also sheet 3
ERR_DETECT: FF2.5(Q) U$378.1 ; also sheet 14
FREQ_PULSE1: U1.W10(GPIO14) ; also sheet 4
FREQ_PULSE2: U1.W7(GPIO6) ; also sheet 4
HEATER_CLK: R98.1 U1.Y11(GPIO17) U$184.1 ; also sheet 3
HEATER_DI: U1.Y10(GPIO16) ; also sheet 3
HEATER_DO: U1.Y9(GPIO13) U$353.1 ; also sheet 3
HEATER_LOAD: U1.V17(GPIO40) U$338.1 ; also sheet 3
I2C_CLOCK: IC23.6(SCL) IC30.6(SCL) R131.1 U1.A17(GPIO70) U$368.1 ; also sheet 2,3,10
I2C_DATA: IC23.5(SDA) IC30.5(SDA) R130.1 U1.B16(GPIO71) U$369.1 ; also sheet 2,3,10
IO72_MFG1: U1.J1(GPIO72) U$181.1 ; also sheet 12
N$36: R12.1 U1.V6(GPIO1) U$351.1
N$44: IC16.12(R1OUT) R12.2 U$360.1
N$100: IC16.11(T1IN) R112.1 U1.W5(GPIO0) U$310.1
N$131: C32.2 IC16.3(C1-) U$365.1
N$143: C32.1 IC16.1(C1+) U$366.1
N$144: C34.1 IC16.4(C2+) U$364.1
N$145: C34.2 IC16.5(C2-) U$361.1
N$146: C33.1 IC16.2(V+) U$311.1
N$147: C35.1 IC16.6(V-) U$312.1
N$167: IC14.3(E:I) R80.1 R87.1 U$397.1
N$168: IC14.5(F:I) R86.1 R89.1 U$394.1
N$170: R101.1 U1.Y12(GPIO20) U$334.1
N$173: IC23.1(X1) X2.1
N$174: IC23.2(X2) X2.4
N$175: G1.+ IC23.3(VBAT) U$370.1
N$280: R99.1 U1.W13(GPIO24) U$348.1
N$281: FF1.5(Q) FF2.2(D) U$374.1
N$282: U1.V11(GPIO18) U$183.1
N$283: U1.W11(GPIO19) U$182.1
N$284: U1.V13(GPIO25) U$346.1
N$285: U1.Y14(GPIO26) U$345.1
N$286: U1.W14(GPIO27) U$344.1
N$287: U1.V14(GPIO29) U$343.1
N$288: U1.W15(GPIO30) U$342.1
N$289: U1.Y16(GPIO31) U$318.1
N$290: U1.V15(GPIO32) U$317.1
N$291: U1.W16(GPIO33) U$226.1
N$292: U1.Y17(GPIO34) U$225.1
N$293: U1.U15(GPIO35) U$193.1
N$294: U1.V16(GPIO36) U$192.1
N$295: U1.W17(GPIO37) U$191.1
N$296: U1.V10(GPIO15) U$313.1
N$299: U1.W12(GPIO21) U$341.1
N$300: U1.V12(GPIO22) U$349.1
N$301: U1.Y13(GPIO23) U$350.1
N$305: IC16.9(R2OUT) U$229.1
N$306: IC23.7(SQW) U$367.1
N$355: IC16.7(T2OUT) U$357.1
N$376: FF1.3(Q/) U$373.1
N$377: FF2.3(Q/) U$381.1
PRODUCT_FLOW_DETECT: R106.1 U1.W9(GPIO12) ; also sheet 3
RST\: FF1.6(CLR/) FF2.7(PRE/) U$375.1
RX0
: U1.W8(GPIO9) U$314.1
SENSOR_LED_ENABLE: U1.C20(GPIO69) ; also sheet 11
TANK_EMPTY: U1.Y6(GPIO5) U$339.1 ; also sheet 11
TANK_HIGH: U1.W6(GPIO3) U$340.1 ; also sheet 11
TANK_LOW: U1.T19(GPIO46) U$331.1 ; also sheet 11
TX0: R108.1 U1.V8(GPIO8) U$355.1 ; also sheet 7
TXCLKB: FF2.1(CLOCK) U1.Y7(GPIO7) U$377.1
Unconnected: G1.+@1(+)

### Buses
B$1
B$2

### Notes on the sheet
- 249889
- Realtime clock
- CPU I/O | CPU I/O
- 2.0

## Sheet 6 of 16
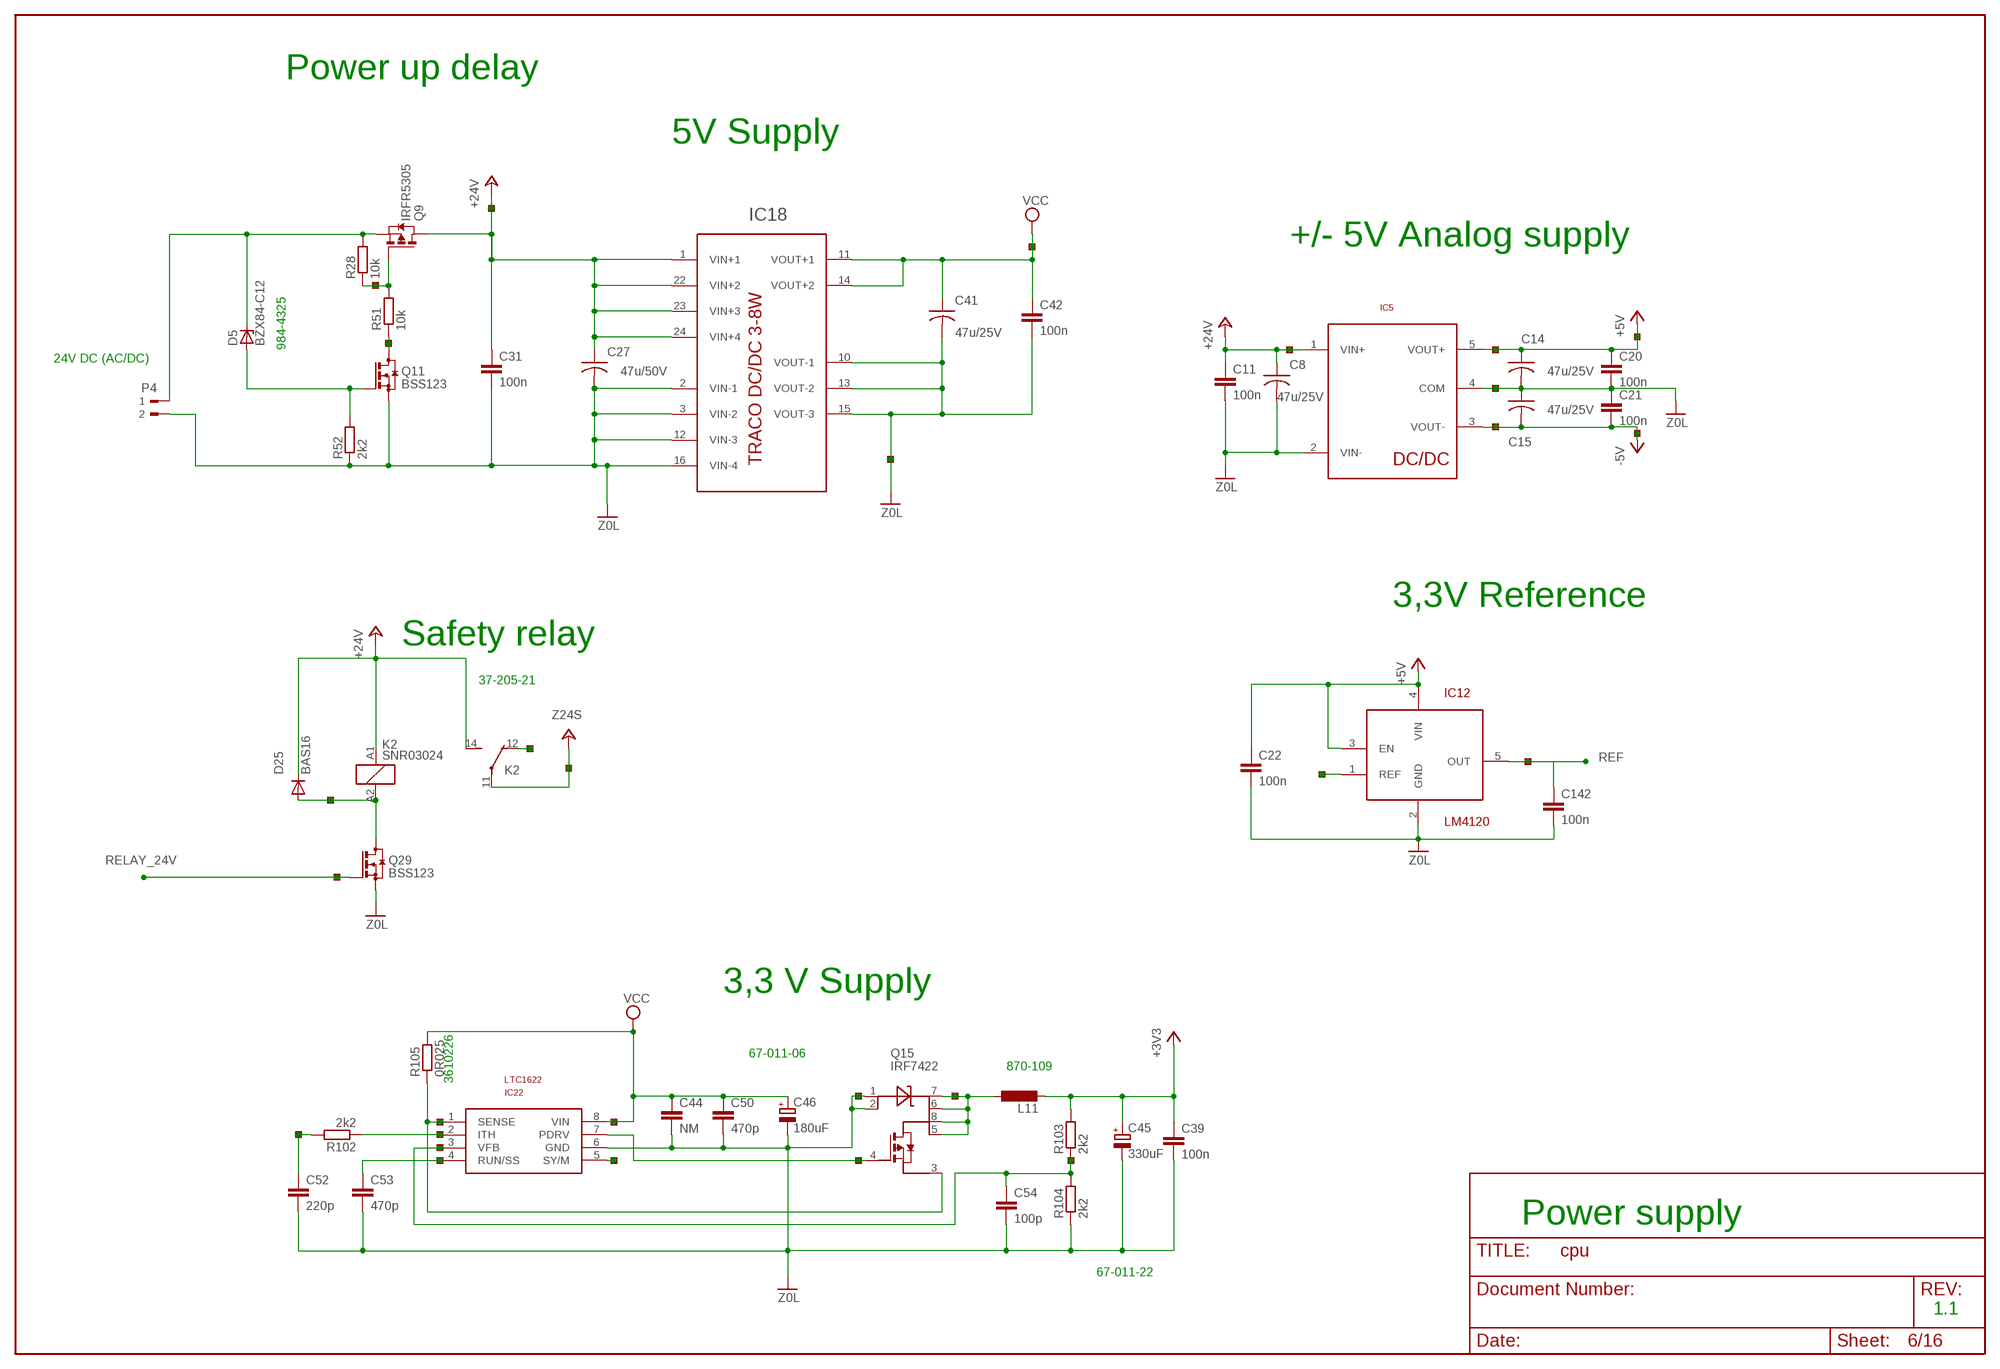
[diagram p6: schematic, sheet 6]

### Parts
C8  47u/25V  CAP2.5  [CAP2.5]
C11  100n  C-EUC1206  [C1206]
C14  47u/25V  CAP2.5  [CAP2.5]
C15  47u/25V  CAP2.5  [CAP2.5]
C20  100n  C-EUC1206  [C1206]
C21  100n  C-EUC1206  [C1206]
C22  100n  C-EUC1206  [C1206]
C27  47u/50V  CAP2.5  [CAP2.5]
C31  100n  C-EUC1206  [C1206]
C39  100n  C-EUC1206  [C1206]
C41  47u/25V  CAP2.5  [CAP2.5]
C42  100n  C-EUC1206  [C1206]
C44  NM  C-EUC1206  [C1206]
C45  330uF  CPOL-EUE3.5-10  [E3,5-10]
C46  180uF  CPOL-EUE3.5-10  [E3,5-10]
C50  470p  C-EUC1206  [C1206]
C52  220p  C-EUC1206  [C1206]
C53  470p  C-EUC1206  [C1206]
C54  100p  C-EUC1206  [C1206]
C142  100n  C-EUC0805K  [C0805K]
D5  BZX84-C12  ZENER-DIODESOT23  [SOT23]
D25  BAS16  [SOT23]
IC5  DC_DC_TRACO_1W_DUAL  [DC_DC_TRACO_1W_DUAL]
IC12  LM4120  [SOT23-5]
IC18  DC_DC_TRACO_8W  [DIL_TRACO_DCDC]
IC22  LTC1622  [SO8]
K2  SNR03024  [SNR-V]
L11  L-EUL5650M  [L5650M]
P4  90-2  [90-2]
Q9  IRFR5305  P-FET-DPAK  [DPAK]
Q11  BSS123  [SOT23]
Q15  IRF7422  [SO8]
Q29  BSS123  [SOT23]
R28  10k  R-EU_R0805W  [R0805W]
R51  10k  R-EU_R0805W  [R0805W]
R52  2k2  R-EU_R0805W  [R0805W]
R102  2k2  R-EU_R0805W  [R0805W]
R103  2k2  R-EU_R0805W  [R0805W]
R104  2k2  R-EU_R0805W  [R0805W]
R105  0R025  R-EU_R2010W  [R2010W]
U$235  TESTPAD  [TESTPAD]
U$236  TESTPAD  [TESTPAD]
U$237  TESTPAD  [TESTPAD]
U$238  TESTPAD  [TESTPAD]
U$239  TESTPAD  [TESTPAD]
U$240  TESTPAD  [TESTPAD]
U$241  TESTPAD  [TESTPAD]
U$242  TESTPAD  [TESTPAD]
U$243  TESTPAD  [TESTPAD]
U$245  TESTPAD  [TESTPAD]
U$246  TESTPAD  [TESTPAD]
U$248  TESTPAD  [TESTPAD]
U$249  TESTPAD  [TESTPAD]
U$250  TESTPAD  [TESTPAD]
U$251  TESTPAD  [TESTPAD]
U$252  TESTPAD  [TESTPAD]
U$253  TESTPAD  [TESTPAD]
U$254  TESTPAD  [TESTPAD]
U$256  TESTPAD  [TESTPAD]
U$257  TESTPAD  [TESTPAD]
U$259  TESTPAD  [TESTPAD]
U$260  TESTPAD  [TESTPAD]
U$261  TESTPAD  [TESTPAD]
U$262  TESTPAD  [TESTPAD]
U$264  TESTPAD  [TESTPAD]
U$398  TESTPAD  [TESTPAD]
U$400  TESTPAD  [TESTPAD]
U$401  TESTPAD  [TESTPAD]

### Nets
0V: C8.2 C11.2 C14.2 C15.1 C20.2 C21.1 C22.2 C27.2 C31.2 C39.2 C41.2 C42.2 C44.2 C45.- C46.- C50.2 C52.2 C53.2 C54.2 C142.1 C142.2 IC5.2(VIN-) IC5.4(COM) IC12.2(GND) IC18.2(VIN-1) IC18.3(VIN-2) IC18.10(VOUT-1) IC18.12(VIN-3) IC18.13(VOUT-2) IC18.15(VOUT-3) IC18.16(VIN-4) IC22.6(GND) P4.2 Q11.2(S) Q15.1 Q15.2 Q29.2(S) R52.1 R104.1 U$240.1 U$248.1 U$256.1 ; supply symbol labelled Z0L ; also sheet 2,3,4,5,7,8,9,10,11,12,13,14,15,16
+3V3: C39.1 C45.+ L11.2 R103.2 ; also sheet 2,3,4,5,7,10,11,12,13,14,15,16
+5V: C14.1 C20.1 C22.1 IC5.5(VOUT+) IC12.3(EN) IC12.4(VIN) U$246.1 U$251.1 ; also sheet 4,9
+24S: K2.11(2:P) U$401.1 ; supply symbol labelled Z24S ; also sheet 3,8,9,11
+24V: C8.1 C11.1 C27.1 C31.1 D25.3(C) IC5.1(VIN+) IC18.1(VIN+1) IC18.22(VIN+2) IC18.23(VIN+3) IC18.24(VIN+4) K2.14(2:S) K2.A1 Q9.4(D) U$238.1 U$250.1 ; also sheet 3,7,8
-5V: C15.2 C21.2 IC5.3(VOUT-) U$249.1 U$252.1 ; also sheet 4,9
N$11: D25.1(A) K2.A2 Q29.3(D) U$400.1
N$148: D5.3(C) P4.1 Q9.3(S) R28.2
N$149: Q11.3(D) R51.1 U$239.1
N$152: Q9.1(G) R28.1 R51.2 U$237.1
N$153: D5.1(A) Q11.1(G) R52.2
N$155: IC22.1(SENSE) Q15.3 R105.1 U$243.1
N$156: IC22.7(PDRV) Q15.4 U$257.1
N$158: IC22.2(ITH) R102.1 U$245.1
N$159: C52.1 R102.2 U$242.1
N$160: L11.1 Q15.5 Q15.6 Q15.7 Q15.8 U$264.1
N$161: C53.1 IC22.4(RUN/SS) U$262.1
N$162: C54.1 IC22.3(VFB) R103.1 R104.2 U$254.1 U$261.1
N$307: IC12.1(REF) U$235.1
N$308: IC22.5(SY/M) U$259.1
N$309: K2.12(2:O) U$241.1
REF: IC12.5(OUT) U$253.1 ; also sheet 2,9
RELAY_24V: Q29.1(G) U$236.1 ; also sheet 10
VCC: C41.1 C42.1 C44.1 C46.+ C50.1 IC18.11(VOUT+1) IC18.14(VOUT+2) IC22.8(VIN) R105.2 U$260.1 U$398.1 ; also sheet 2,3,7,10,11

### Notes on the sheet
- Power up delay
- 5V Supply
- +/- 5V Analog supply
- 984-4325
- 24V DC (AC/DC)
- 3,3V Reference
- Safety relay
- 37-205-21
- 3,3 V Supply
- 67-011-06
- 870-109
- 3610226
- Power supply
- 67-011-22
- 1.1

## Sheet 7 of 16
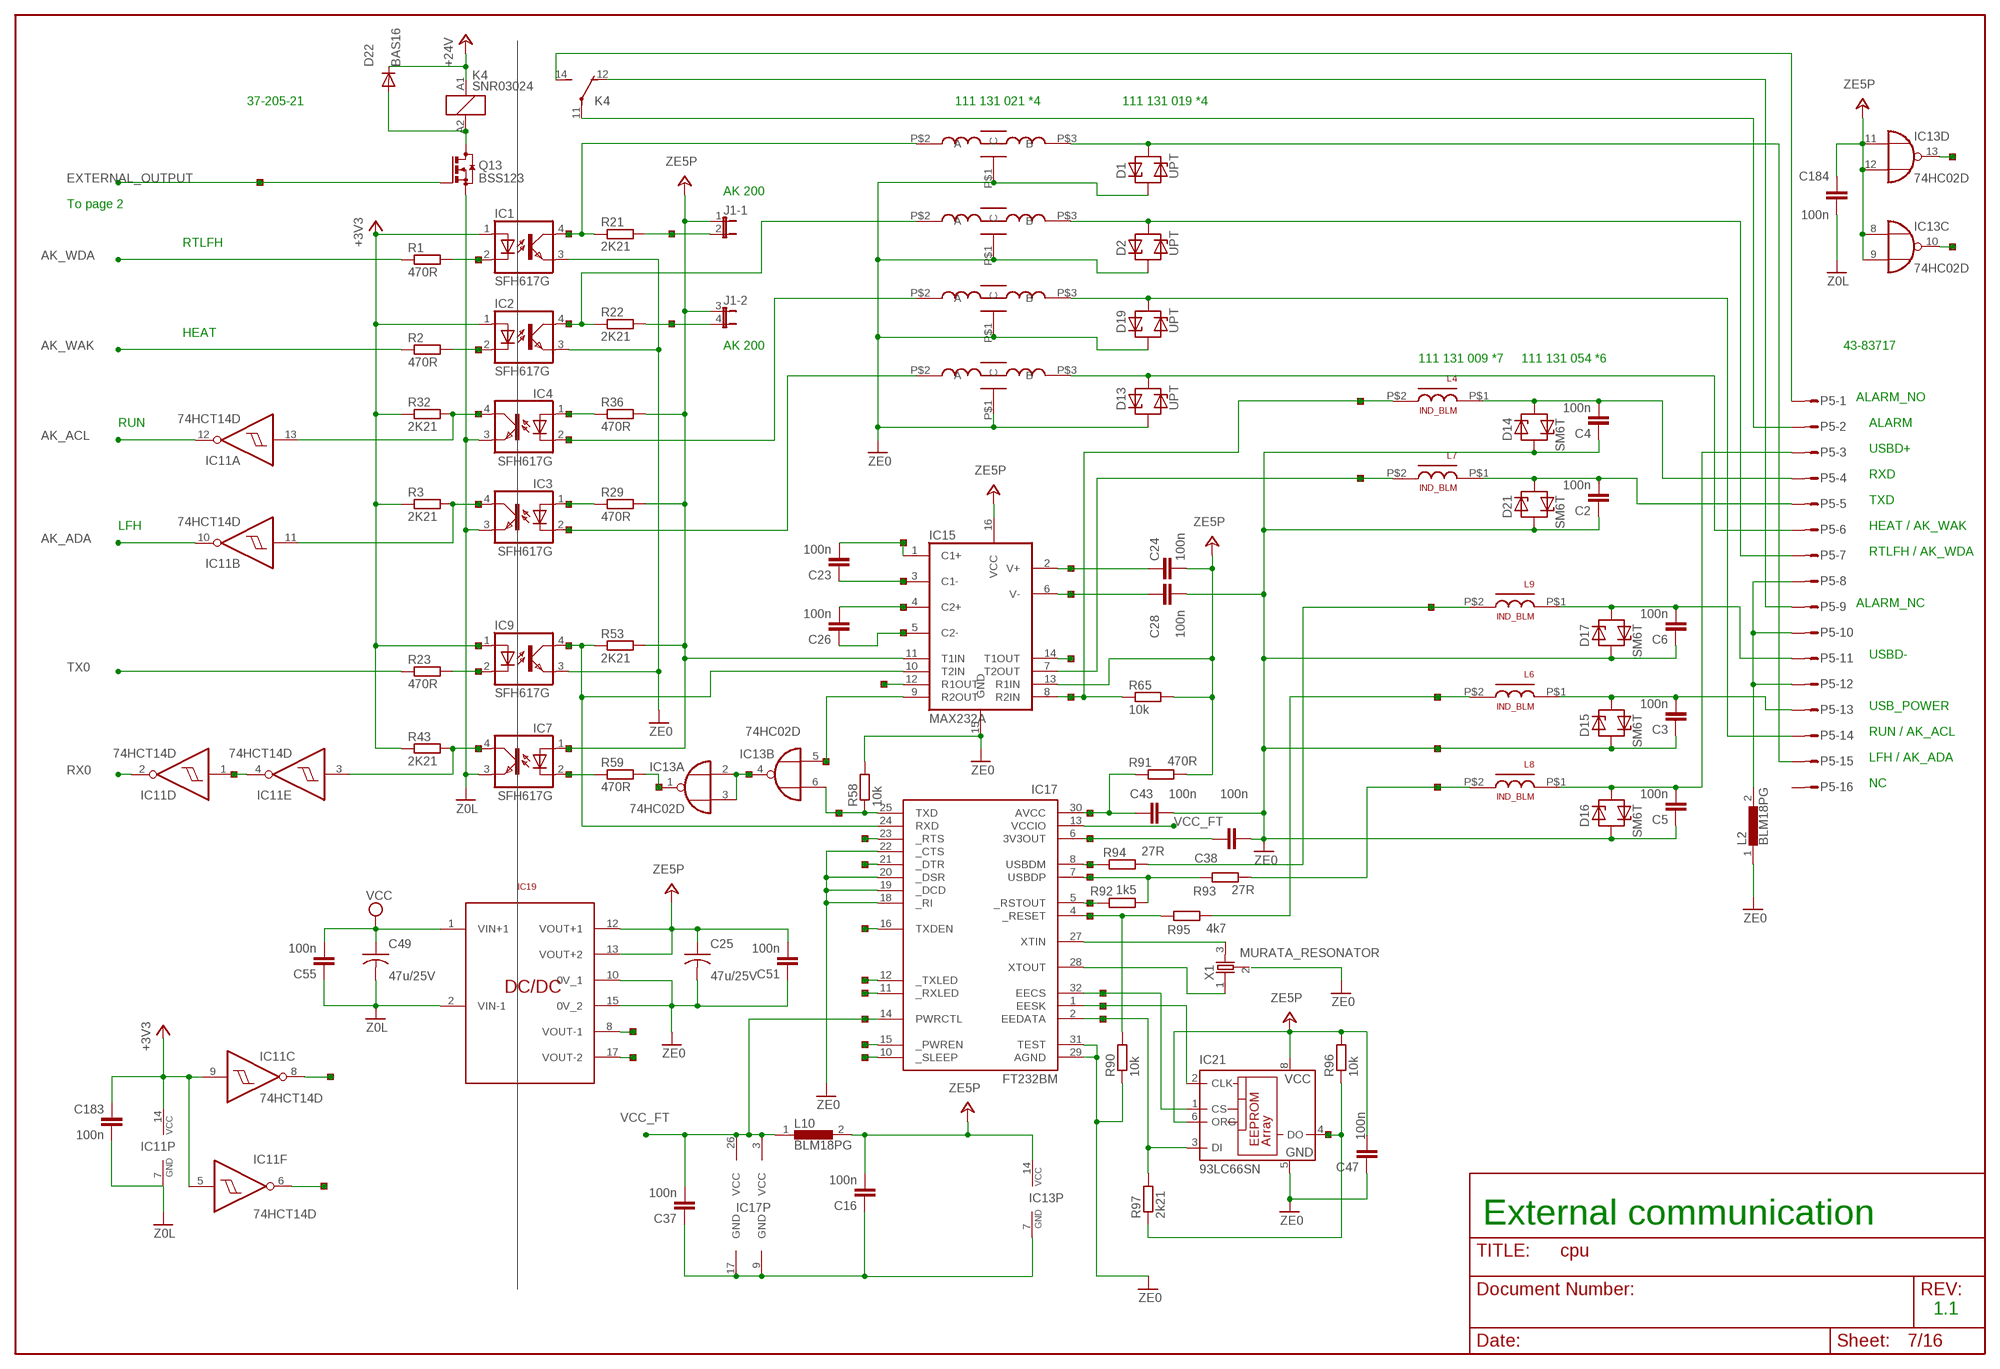
[diagram p7: schematic, sheet 7]

### Parts
C2  100n  C-EUC0805K  [C0805K]
C3  100n  C-EUC0805K  [C0805K]
C4  100n  C-EUC0805K  [C0805K]
C5  100n  C-EUC0805K  [C0805K]
C6  100n  C-EUC0805K  [C0805K]
C16  100n  C-EUC0805K  [C0805K]
C23  100n  C-EUC0805K  [C0805K]
C24  100n  C-EUC0805K  [C0805K]
C25  47u/25V  CAP2.5  [CAP2.5]
C26  100n  C-EUC0805K  [C0805K]
C28  100n  C-EUC0805K  [C0805K]
C37  100n  C-EUC0805K  [C0805K]
C38  100n  C-EUC0805K  [C0805K]
C43  100n  C-EUC0805K  [C0805K]
C47  100n  C-EUC0805K  [C0805K]
C49  47u/25V  CAP2.5  [CAP2.5]
C51  100n  C-EUC0805K  [C0805K]
C55  100n  C-EUC0805K  [C0805K]
C183  100n  C-EUC0805K  [C0805K]
C184  100n  C-EUC0805K  [C0805K]
D1  UPT  [UPT]
D2  UPT  [UPT]
D13  UPT  [UPT]
D14  SM6T  [SMB]
D15  SM6T  [SMB]
D16  SM6T  [SMB]
D17  SM6T  [SMB]
D19  UPT  [UPT]
D21  SM6T  [SMB]
D22  BAS16  [SOT23]
F1  T_FILTER  [T_FILTER]
F2  T_FILTER  [T_FILTER]
F3  T_FILTER  [T_FILTER]
F4  T_FILTER  [T_FILTER]
IC1  SFH617G  [DIL04B]
IC2  SFH617G  [DIL04B]
IC3  SFH617G  [DIL04B]
IC4  SFH617G  [DIL04B]
IC7  SFH617G  [DIL04B]
IC9  SFH617G  [DIL04B]
IC11  74HCT14D  [SO14]
IC13  74HC02D  [SO14]
IC15  MAX232A  [SO16]
IC17  FT232BM  [LQFP32]
IC19  DC_DC_NMSC  [DIL_NMSC_DCDC]
IC21  93LC66SN  [SO-08]
J1  JP2QE  [JP2Q]
K4  SNR03024  [SNR-V]
L2  BLM18PG  L1210  [L-0603]
L4  IND_BLM  [IND_BLM]
L6  IND_BLM  [IND_BLM]
L7  IND_BLM  [IND_BLM]
L8  IND_BLM  [IND_BLM]
L9  IND_BLM  [IND_BLM]
L10  BLM18PG  L1210  [L-0603]
P5  MODU16  [MODU16]
Q13  BSS123  [SOT23]
R1  470R  R-EU_R0805W  [R0805W]
R2  470R  R-EU_R0805W  [R0805W]
R3  2K21  R-EU_R0805W  [R0805W]
R21  2K21  R-EU_R0805W  [R0805W]
R22  2K21  R-EU_R0805W  [R0805W]
R23  470R  R-EU_R0805W  [R0805W]
R29  470R  R-EU_R0805W  [R0805W]
R32  2K21  R-EU_R0805W  [R0805W]
R36  470R  R-EU_R0805W  [R0805W]
R43  2K21  R-EU_R0805W  [R0805W]
R53  2K21  R-EU_R0805W  [R0805W]
R58  10k  R-EU_R0805W  [R0805W]
R59  470R  R-EU_R0805W  [R0805W]
R65  10k  R-EU_R0805W  [R0805W]
R90  10k  R-EU_R0805W  [R0805W]
R91  470R  R-EU_R0805W  [R0805W]
R92  1k5  R-EU_R0805W  [R0805W]
R93  27R  R-EU_R0805W  [R0805W]
R94  27R  R-EU_R0805W  [R0805W]
R95  4k7  R-EU_R0805W  [R0805W]
R96  10k  R-EU_R0805W  [R0805W]
R97  2k21  R-EU_R0805W  [R0805W]
U$169  TESTPAD  [TESTPAD]
U$170  TESTPAD  [TESTPAD]
U$171  TESTPAD  [TESTPAD]
U$233  TESTPAD  [TESTPAD]
U$255  TESTPAD  [TESTPAD]
U$266  TESTPAD  [TESTPAD]
U$267  TESTPAD  [TESTPAD]
U$268  TESTPAD  [TESTPAD]
U$269  TESTPAD  [TESTPAD]
U$270  TESTPAD  [TESTPAD]
U$271  TESTPAD  [TESTPAD]
U$272  TESTPAD  [TESTPAD]
U$274  TESTPAD  [TESTPAD]
U$276  TESTPAD  [TESTPAD]
U$277  TESTPAD  [TESTPAD]
U$278  TESTPAD  [TESTPAD]
U$279  TESTPAD  [TESTPAD]
U$280  TESTPAD  [TESTPAD]
U$281  TESTPAD  [TESTPAD]
U$282  TESTPAD  [TESTPAD]
U$283  TESTPAD  [TESTPAD]
U$285  TESTPAD  [TESTPAD]
U$286  TESTPAD  [TESTPAD]
U$287  TESTPAD  [TESTPAD]
U$288  TESTPAD  [TESTPAD]
U$289  TESTPAD  [TESTPAD]
U$290  TESTPAD  [TESTPAD]
U$291  TESTPAD  [TESTPAD]
U$292  TESTPAD  [TESTPAD]
U$293  TESTPAD  [TESTPAD]
U$294  TESTPAD  [TESTPAD]
U$295  TESTPAD  [TESTPAD]
U$296  TESTPAD  [TESTPAD]
U$297  TESTPAD  [TESTPAD]
U$298  TESTPAD  [TESTPAD]
U$299  TESTPAD  [TESTPAD]
U$300  TESTPAD  [TESTPAD]
U$307  TESTPAD  [TESTPAD]
U$308  TESTPAD  [TESTPAD]
U$315  TESTPAD  [TESTPAD]
U$319  TESTPAD  [TESTPAD]
U$320  TESTPAD  [TESTPAD]
U$321  TESTPAD  [TESTPAD]
U$322  TESTPAD  [TESTPAD]
U$323  TESTPAD  [TESTPAD]
U$324  TESTPAD  [TESTPAD]
U$325  TESTPAD  [TESTPAD]
U$326  TESTPAD  [TESTPAD]
U$327  TESTPAD  [TESTPAD]
U$328  TESTPAD  [TESTPAD]
U$329  TESTPAD  [TESTPAD]
U$330  TESTPAD  [TESTPAD]
U$362  TESTPAD  [TESTPAD]
U$363  TESTPAD  [TESTPAD]
U$379  TESTPAD  [TESTPAD]
U$380  TESTPAD  [TESTPAD]
U$386  TESTPAD  [TESTPAD]
U$389  TESTPAD  [TESTPAD]
U$391  TESTPAD  [TESTPAD]
U$392  TESTPAD  [TESTPAD]
U$408  TESTPAD  [TESTPAD]
U$409  TESTPAD  [TESTPAD]
U$410  TESTPAD  [TESTPAD]
X1  MURATA_RESONATOR  [MURATA_RESONATOR]

### Nets
0V: C49.2 C55.1 C183.2 C184.1 IC3.3(EMIT) IC4.3(EMIT) IC7.3(EMIT) IC11.7(P:GND) IC19.2(VIN-1) Q13.2(S) ; supply symbol labelled Z0L ; also sheet 2,3,4,5,6,8,9,10,11,12,13,14,15,16
+3V3: C183.1 IC1.1(A) IC2.1(A) IC9.1(A) IC11.5(F:I) IC11.9(C:I) IC11.14(P:VCC) R3.1 R32.1 R43.1 U$270.1 ; also sheet 2,3,4,5,6,10,11,12,13,14,15,16
+24V: D22.3(C) K4.A1 ; also sheet 3,6,8
AK_ACL: IC11.12(A:O) ; also sheet 5
AK_ADA: IC11.10(B:O) ; also sheet 5
AK_WAK: R2.1
AK_WDA: R1.1
EXTERNAL_OUTPUT: Q13.1(G) U$255.1 ; also sheet 2
N$14: IC13.1(A:O) R59.2 U$281.1
N$21: IC15.12(R1OUT) U$299.1
N$22: IC13.2(A:I0) IC13.3(A:I1) IC13.4(B:O) U$282.1
N$23: IC13.5(B:I0) IC15.9(R2OUT) U$290.1
N$24: IC11.1(D:I) IC11.4(E:O) U$267.1
N$26: IC13.6(B:I1) IC17.25(TXD) R58.1 U$289.1
N$38: IC15.8(R2IN) L4.P$2 R65.1 U$315.1 U$389.1
N$45: C23.2 IC15.1(C1+) U$293.1
N$54: C23.1 IC15.3(C1-) U$294.1
N$56: IC1.2(C) R1.2 U$266.1
N$58: IC2.2(C) R2.2 U$272.1
N$61: IC4.1(A) R36.1 U$278.1
N$62: IC3.1(A) R29.1 U$292.1
N$63: J1.2 R21.2 U$287.1
N$64: J1.4 R22.2 U$288.1
N$65: IC17.4(_RESET) R90.2 R95.1 U$379.1
N$66: L2.2 P5.P$8 P5.P$14 P5.P$16
N$67: IC3.4(COL) IC11.11(B:I) R3.2 U$274.1
N$68: IC4.4(COL) IC11.13(A:I) R32.2 U$271.1
N$69: IC9.2(C) R23.2 U$269.1
N$70: IC9.4(COL) IC15.10(T2IN) IC17.24(RXD) R53.1 U$286.1
N$71: IC7.2(C) R59.1 U$285.1
N$72: K4.12(2:O) P5.P$13
N$73: K4.11(2:P) P5.P$2
N$74: K4.14(2:S) P5.P$1
N$78: F4.P$2(A) IC4.2(C) U$291.1
N$79: IC21.4(DO) R96.1 R97.1 U$329.1
N$80: IC17.2(EEDATA) IC21.3(DI) R97.2 U$363.1
N$81: IC17.32(EECS) IC21.1(CS) U$330.1
N$82: IC17.1(EESK) IC21.2(CLK) U$362.1
N$83: IC17.5(_RSTOUT) R92.1 U$328.1
N$87: C43.1 IC17.30(AVCC) R91.1 U$323.1
N$88: C38.1 IC17.6(3V3OUT) U$324.1
N$89: C26.2 IC15.4(C2+) U$307.1
N$93: D22.1(A) K4.A2 Q13.3(D)
N$94: C26.1 IC15.5(C2-) U$308.1
N$95: C24.1 IC15.2(V+) U$320.1
N$96: C28.1 IC15.6(V-) U$319.1
N$99: F2.P$2(A) IC2.4(COL) R22.1 U$277.1
N$110: C2.2 D21.A L7.P$1 P5.P$5
N$111: C5.2 D16.A L8.P$1 P5.P$3
N$112: F1.P$2(A) IC1.4(COL) R21.1 U$276.1
N$113: C6.2 D17.A L9.P$1 P5.P$15
N$114: C3.2 D15.A L6.P$1 P5.P$17
N$115: F3.P$2(A) IC3.2(C) U$408.1
N$116: D1.P$2(C) F1.P$3(B) P5.P$19
N$117: D2.P$2(C) F2.P$3(B) P5.P$7
N$118: IC15.7(T2OUT) L7.P$2 U$327.1
N$119: C4.2 D14.A L4.P$1 P5.P$4
N$120: D19.P$2(C) F4.P$3(B) P5.P$18
N$121: D13.P$2(C) F3.P$3(B) P5.P$6
N$123: L9.P$2 R94.2 U$391.1
N$125: L6.P$2 R95.2 U$392.1
N$126: L8.P$2 R93.2 U$410.1
N$150: IC17.8(USBDM) R94.1 U$325.1
N$151: IC17.7(USBDP) R92.2 R93.1 U$326.1
N$171: IC17.27(XTIN) X1.3
N$172: IC17.28(XTOUT) X1.1
N$310: IC17.10(_SLEEP) U$298.1
N$311: IC17.15(_PWREN) U$297.1
N$312: IC17.11(_RXLED) U$296.1
N$313: IC17.12(_TXLED) U$295.1
N$314: IC17.16(TXDEN) U$280.1
N$315: IC17.21(_DTR) U$233.1
N$316: IC17.23(_RTS) U$171.1
N$317: IC15.14(T1OUT) U$279.1
N$318: IC19.8(VOUT-1) U$169.1
N$319: IC19.17(VOUT-2) U$170.1
N$320: IC11.8(C:O) U$321.1
N$321: IC11.6(F:O) U$322.1
N$322: C16.1 C37.1 IC13.7(P:GND) IC17.9(GND) IC17.17(GND)
N$338: IC13.13(D:O) U$380.1
N$339: IC13.10(C:O) U$386.1
R: IC7.4(COL) IC11.3(E:I) R43.2 U$268.1
RX0: IC11.2(D:O)
TX0: R23.1 ; also sheet 5
VCC: C49.1 C55.2 IC19.1(VIN+1) ; also sheet 2,3,6,10,11
VCC_FT: C37.2 IC17.3(VCC) IC17.13(VCCIO) IC17.14(PWRCTL) IC17.26(VCC) L10.1 U$300.1
ZE0V: C2.1 C3.1 C4.1 C5.1 C6.1 C25.2 C28.2 C38.2 C43.2 C47.1 C51.1 D1.P$1(A) D2.P$1(A) D13.P$1(A) D14.C D15.C D16.C D17.C D19.P$1(A) D21.C F1.P$1(C) F2.P$1(C) F3.P$1(C) F4.P$1(C) IC1.3(EMIT) IC2.3(EMIT) IC9.3(EMIT) IC15.15(GND) IC17.18(_RI) IC17.19(_DCD) IC17.20(_DSR) IC17.22(_CTS) IC17.29(AGND) IC17.31(TEST) IC19.10(0V_1) IC19.15(0V_2) IC21.5(GND) L2.1 R58.2 R90.1 U$409.1 X1.2 ; supply symbol labelled ZE0
ZE5V: C16.2 C24.2 C25.1 C47.2 C51.2 C184.2 IC7.1(A) IC13.8(C:I0) IC13.9(C:I1) IC13.11(D:I0) IC13.12(D:I1) IC13.14(P:VCC) IC15.11(T1IN) IC15.13(R1IN) IC15.16(VCC) IC19.12(VOUT+1) IC19.13(VOUT+2) IC21.6(ORG) IC21.8(VCC) J1.1 J1.3 L10.2 R29.2 R36.2 R53.2 R65.2 R91.2 R96.2 U$283.1 ; supply symbol labelled ZE5P
Unconnected: IC21.7(NU) P5.P$20

### Notes on the sheet
- 37-205-21 | 111 131 021 *4 | 111 131 019 *4
- AK 200
- To page 2
- RTLFH
- HEAT
- AK 200 | 43-83717
- 111 131 009 *7 | 111 131 054 *6
- ALARM_NO
- RUN | ALARM
- USBD+
- RXD
- TXD
- LFH | HEAT / AK_WAK
- RTLFH / AK_WDA
- ALARM_NC
- USBD-
- USB_POWER
- RUN / AK_ACL
- LFH / AK_ADA
- NC
- External communication
- 1.1

## Sheet 8 of 16
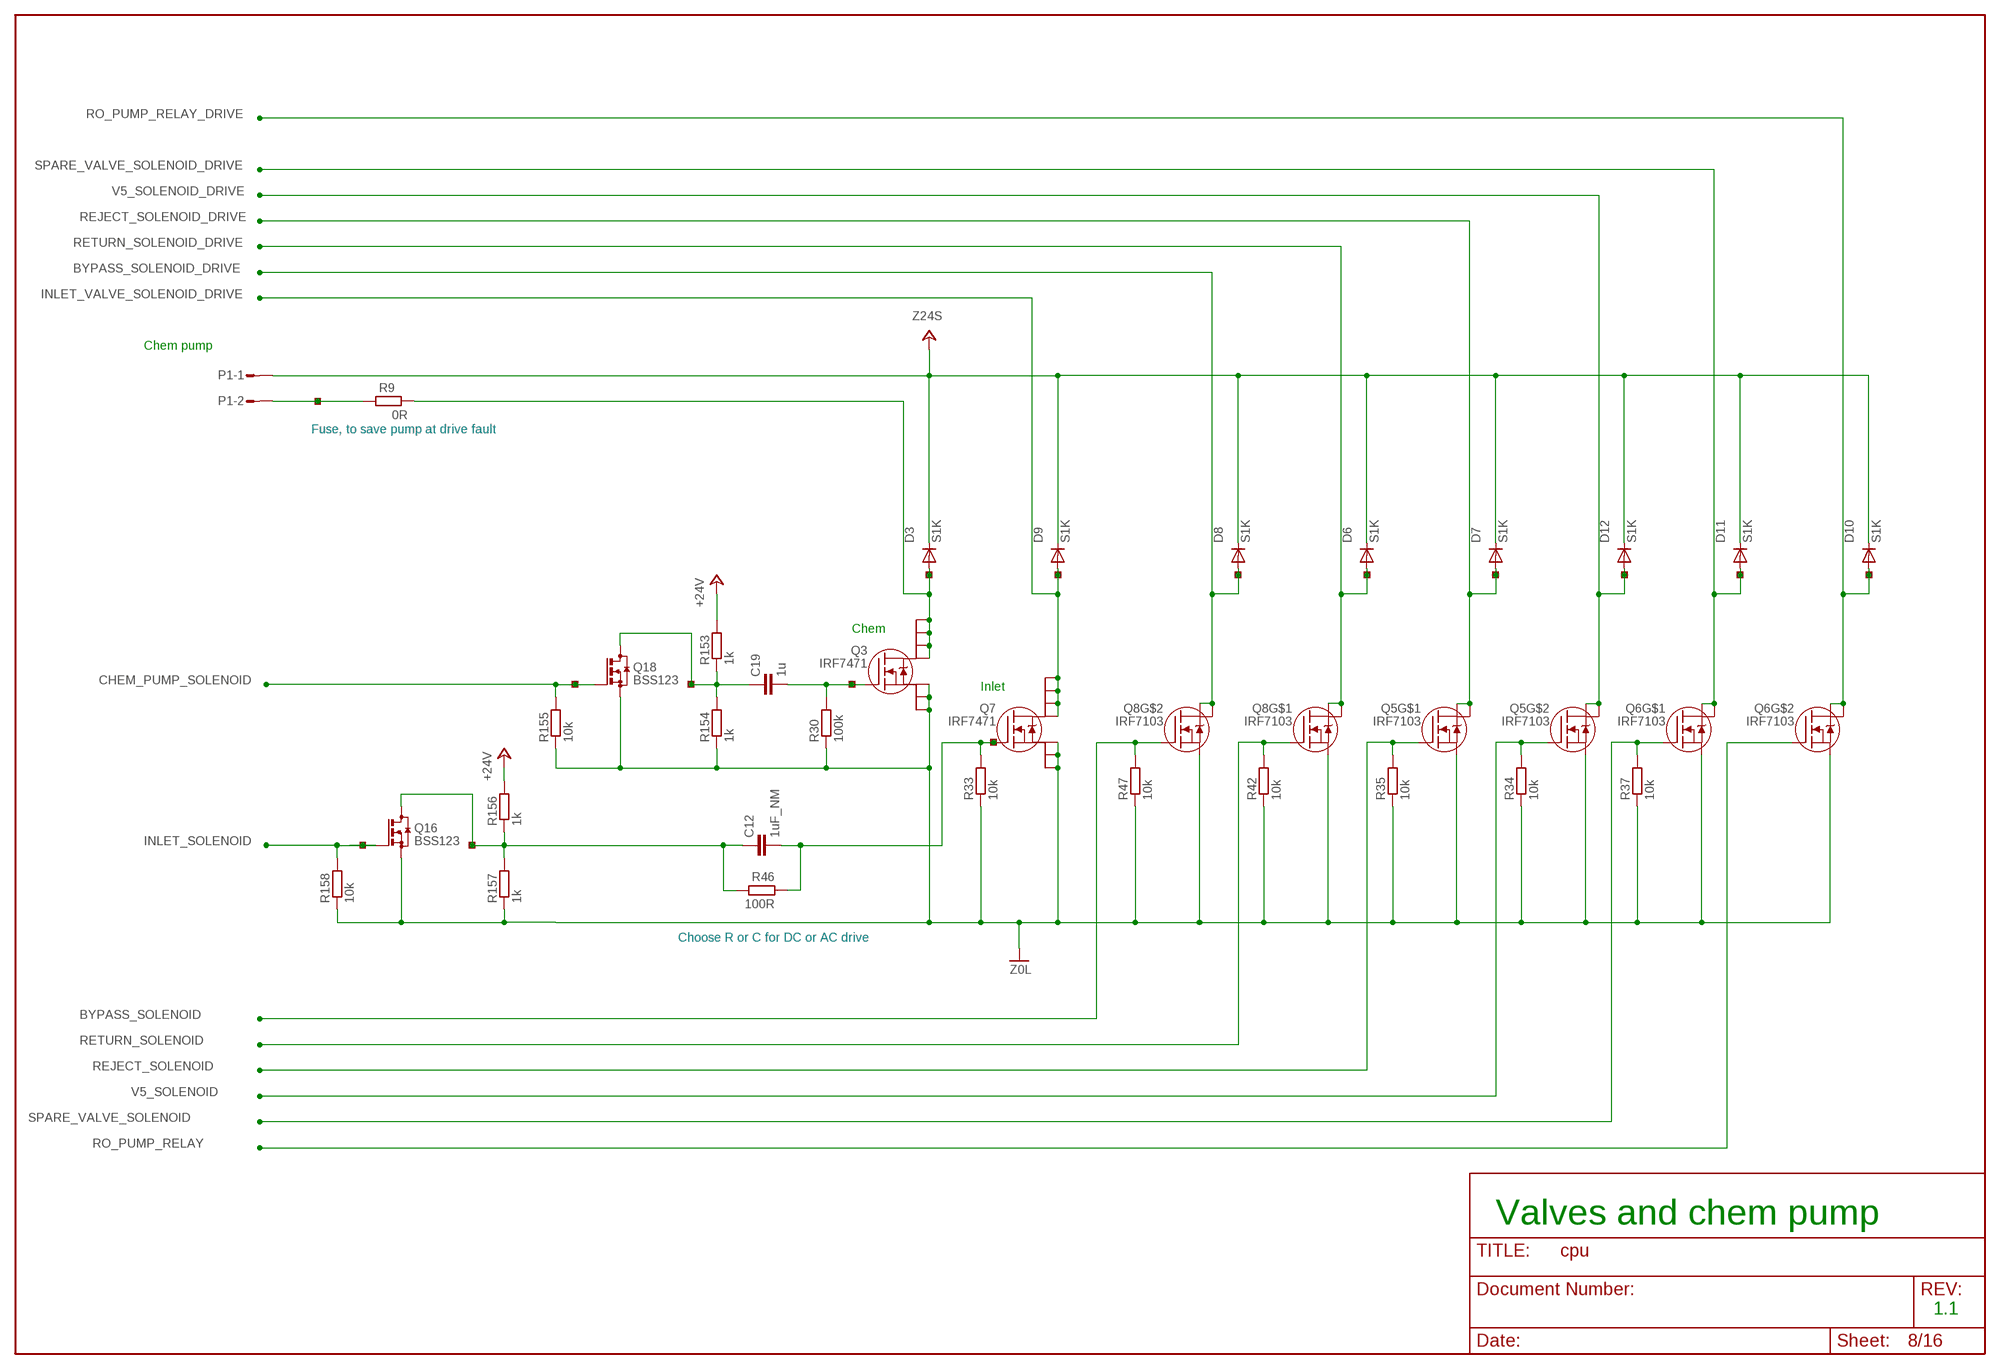
[diagram p8: schematic, sheet 8]

### Parts
C12  1uF_NM  C-EUC0805K  [C0805K]
C19  1u  C-EUC0805K  [C0805K]
D3  S1K  D_DO214AC  [DO214AC]
D6  S1K  D_DO214AC  [DO214AC]
D7  S1K  D_DO214AC  [DO214AC]
D8  S1K  D_DO214AC  [DO214AC]
D9  S1K  D_DO214AC  [DO214AC]
D10  S1K  D_DO214AC  [DO214AC]
D11  S1K  D_DO214AC  [DO214AC]
D12  S1K  D_DO214AC  [DO214AC]
P1  L02P  [L02P]
Q3  IRF7471  IRF7455  [SO8]
Q5  IRF7103  [SO8-2]
Q6  IRF7103  [SO8-2]
Q7  IRF7471  IRF7455  [SO8]
Q8  IRF7103  [SO8-2]
Q16  BSS123  [SOT23]
Q18  BSS123  [SOT23]
R9  0R  R-EU_R0805W  [R0805W]
R30  100k  R-EU_R0805W  [R0805W]
R33  10k  R-EU_R0805W  [R0805W]
R34  10k  R-EU_R0805W  [R0805W]
R35  10k  R-EU_R0805W  [R0805W]
R37  10k  R-EU_R0805W  [R0805W]
R42  10k  R-EU_R0805W  [R0805W]
R46  100R  R-EU_R0805W  [R0805W]
R47  10k  R-EU_R0805W  [R0805W]
R153  1k  R-EU_R0805W  [R0805W]
R154  1k  R-EU_R0805W  [R0805W]
R155  10k  R-EU_R0805W  [R0805W]
R156  1k  R-EU_R0805W  [R0805W]
R157  1k  R-EU_R0805W  [R0805W]
R158  10k  R-EU_R0805W  [R0805W]
U$387  TESTPAD  [TESTPAD]
U$388  TESTPAD  [TESTPAD]
U$390  TESTPAD  [TESTPAD]
U$393  TESTPAD  [TESTPAD]
U$396  TESTPAD  [TESTPAD]
U$411  TESTPAD  [TESTPAD]
U$413  TESTPAD  [TESTPAD]
U$414  TESTPAD  [TESTPAD]
U$415  TESTPAD  [TESTPAD]
U$416  TESTPAD  [TESTPAD]
U$417  TESTPAD  [TESTPAD]
U$418  TESTPAD  [TESTPAD]
U$542  TESTPAD  [TESTPAD]
U$543  TESTPAD  [TESTPAD]
U$555  TESTPAD  [TESTPAD]

### Nets
0V: Q3.1(S2) Q3.2(S1) Q3.3(S) Q5.1(S) Q5.3(S) Q6.1(S) Q6.3(S) Q7.1(S2) Q7.2(S1) Q7.3(S) Q8.1(S) Q8.3(S) Q16.2(S) Q18.2(S) R30.1 R33.1 R34.1 R35.1 R37.1 R42.1 R47.1 R154.1 R155.1 R157.1 R158.1 ; supply symbol labelled Z0L ; also sheet 2,3,4,5,6,7,9,10,11,12,13,14,15,16
+24S: D3.C D6.C D7.C D8.C D9.C D10.C D11.C D12.C P1.1 ; supply symbol labelled Z24S ; also sheet 3,6,9,11
+24V: R153.2 R156.2 ; also sheet 3,6,7
BYPASS_SOLENOID: Q8.4(G) R47.2 ; also sheet 2
BYPASS_SOLENOID_DRIVE: D8.A Q8.5(D) Q8.6(D) U$393.1 ; also sheet 11
CHEM_PUMP_SOLENOID: Q18.1(G) R155.2 U$416.1 ; also sheet 5
INLET_SOLENOID: C12.1 Q16.1(G) Q16.3(D) R46.2 R156.1 R157.2 R158.2 U$417.1 U$418.1 ; also sheet 2
INLET_VALVE_SOLENOID_DRIVE: D9.A Q7.5(D) Q7.6(D) Q7.7(D) Q7.8(D) U$390.1 ; also sheet 11
N$9: Q3.4(G) U$555.1
N$34: Q7.4(G) R33.2 U$396.1
N$46: D3.A Q3.5(D) Q3.6(D) Q3.7(D) Q3.8(D) R9.1 U$388.1
N$48: P1.2 R9.2 U$387.1
N$60: C19.2 R30.2
N$75: C12.2 R46.1
N$77: C19.1 Q18.3(D) R153.1 R154.2 U$415.1
REJECT_SOLENOID: Q5.2(G) R35.2 ; also sheet 2
REJECT_SOLENOID_DRIVE: D7.A Q5.7(D) Q5.8(D) U$413.1 ; also sheet 11
RETURN_SOLENOID: Q8.2(G) R42.2 ; also sheet 2
RETURN_SOLENOID_DRIVE: D6.A Q8.7(D) Q8.8(D) U$411.1 ; also sheet 11
RO_PUMP_RELAY: Q6.4(G) ; also sheet 2
RO_PUMP_RELAY_DRIVE: D10.A Q6.5(D) Q6.6(D) U$543.1 ; also sheet 3
SPARE_VALVE_SOLENOID: Q6.2(G) R37.2 ; also sheet 2
SPARE_VALVE_SOLENOID_DRIVE: D11.A Q6.7(D) Q6.8(D) U$542.1 ; also sheet 3
V5_SOLENOID: Q5.4(G) R34.2 ; also sheet 2
V5_SOLENOID_DRIVE: D12.A Q5.5(D) Q5.6(D) U$414.1 ; also sheet 3

### Notes on the sheet
- Chem pump
- Fuse, to save pump at drive fault
- Chem
- Inlet
- Choose R or C for DC or AC drive
- Valves and chem pump
- 1.1

## Sheet 9 of 16
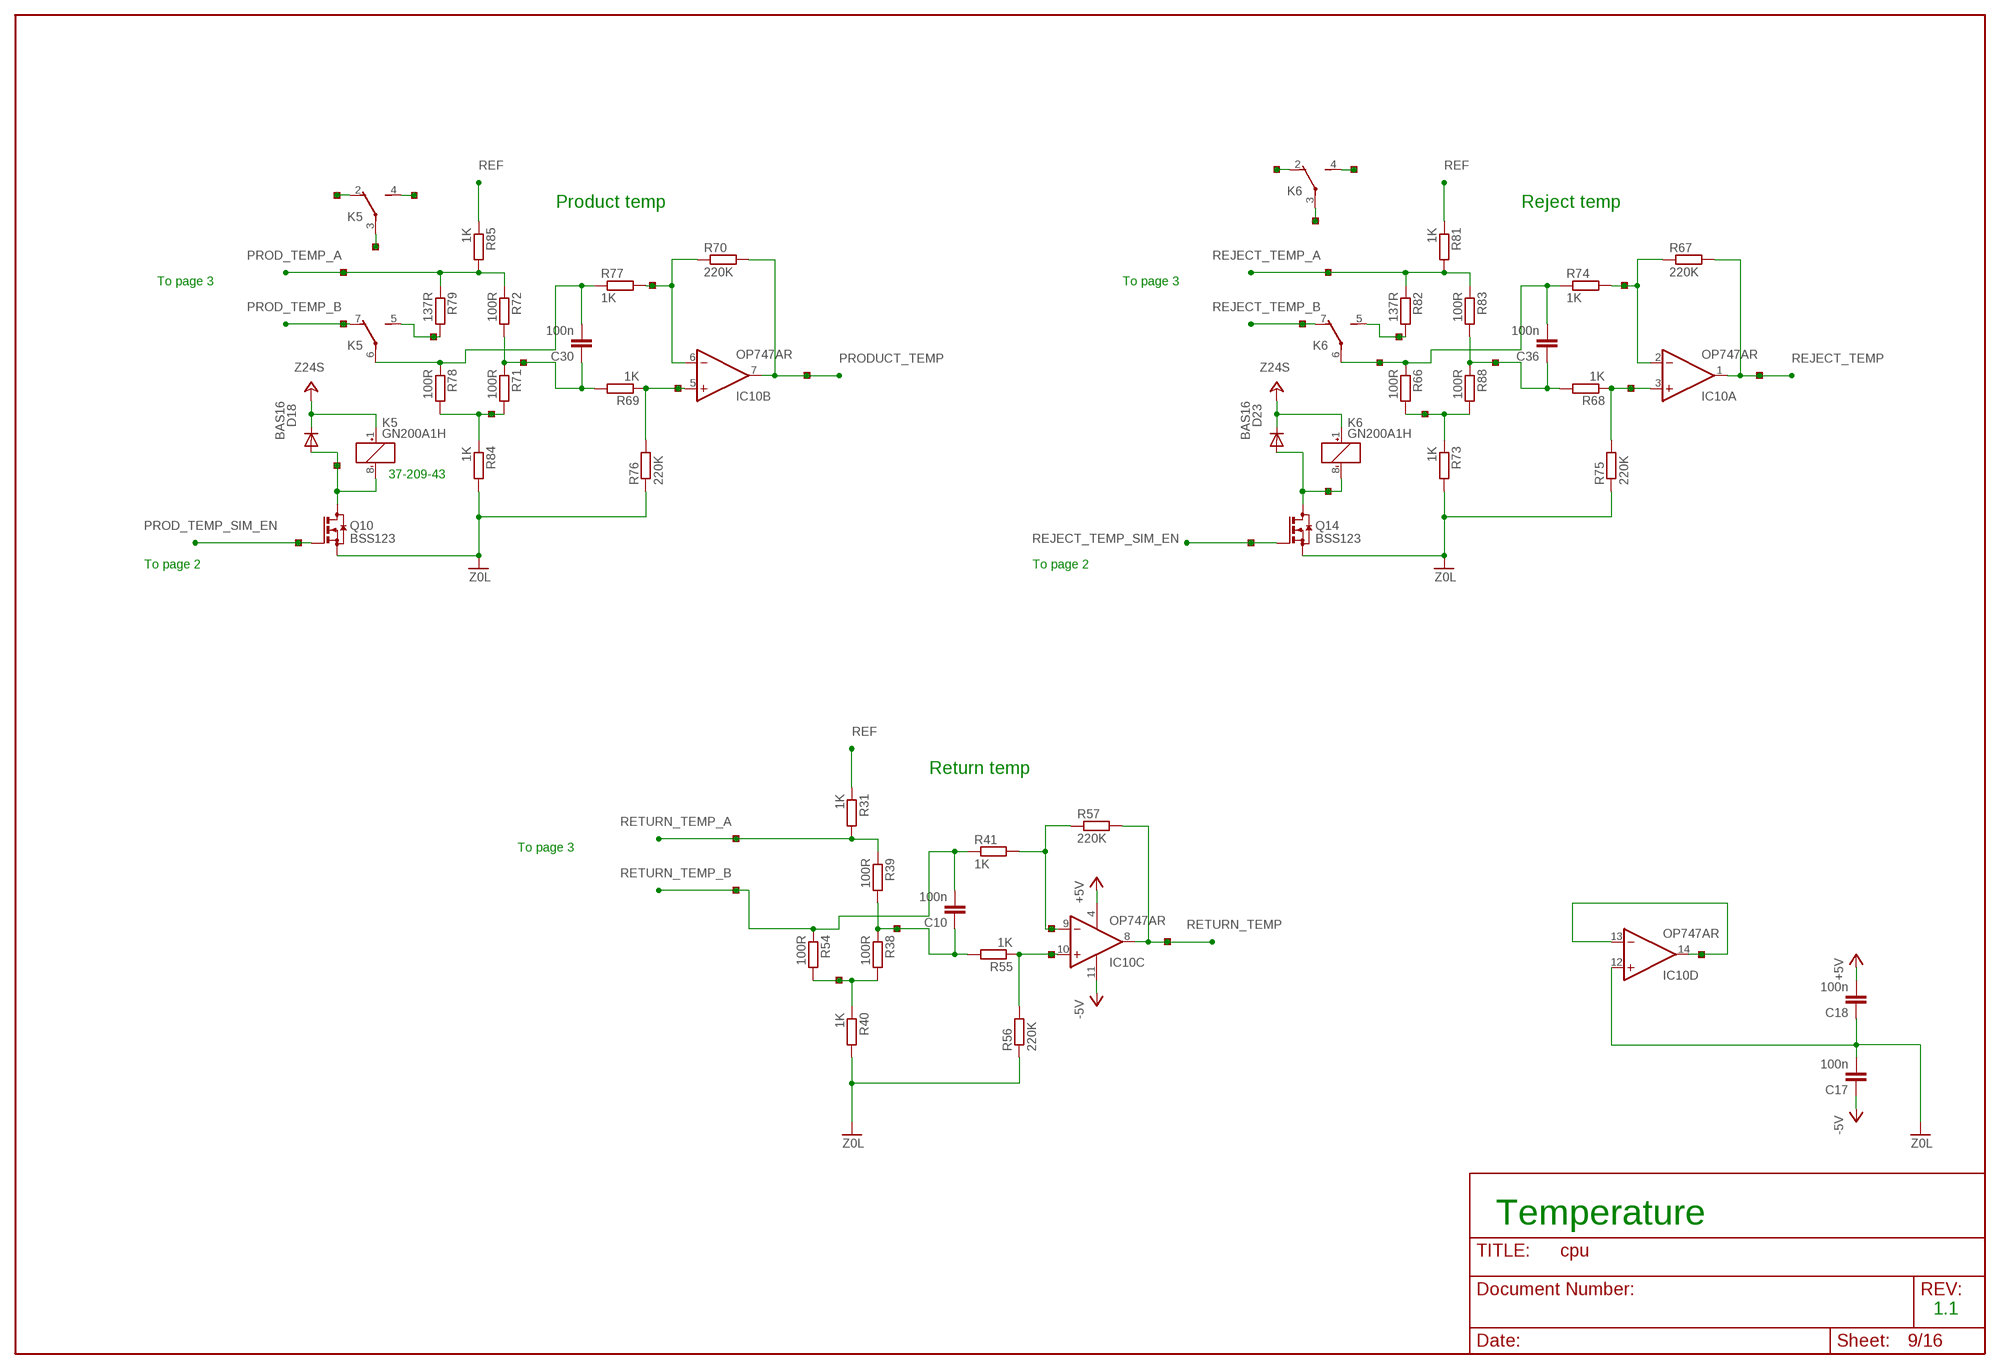
[diagram p9: schematic, sheet 9]

### Parts
C10  100n  C-EUC0805K  [C0805K]
C17  100n  C-EUC0805K  [C0805K]
C18  100n  C-EUC0805K  [C0805K]
C30  100n  C-EUC0805K  [C0805K]
C36  100n  C-EUC0805K  [C0805K]
D18  BAS16  [SOT23]
D23  BAS16  [SOT23]
IC10  OP747AR  LF347D  [SO14]
K5  GN200A1H  [GN-A]
K6  GN200A1H  [GN-A]
Q10  BSS123  [SOT23]
Q14  BSS123  [SOT23]
R31  1K  R-EU_R0805W  [R0805W]
R38  100R  R-EU_R0805W  [R0805W]
R39  100R  R-EU_R0805W  [R0805W]
R40  1K  R-EU_R0805W  [R0805W]
R41  1K  R-EU_R0805W  [R0805W]
R54  100R  R-EU_R0805W  [R0805W]
R55  1K  R-EU_R0805W  [R0805W]
R56  220K  R-EU_R0805W  [R0805W]
R57  220K  R-EU_R0805W  [R0805W]
R66  100R  R-EU_R0805W  [R0805W]
R67  220K  R-EU_R0805W  [R0805W]
R68  1K  R-EU_R0805W  [R0805W]
R69  1K  R-EU_R0805W  [R0805W]
R70  220K  R-EU_R0805W  [R0805W]
R71  100R  R-EU_R0805W  [R0805W]
R72  100R  R-EU_R0805W  [R0805W]
R73  1K  R-EU_R0805W  [R0805W]
R74  1K  R-EU_R0805W  [R0805W]
R75  220K  R-EU_R0805W  [R0805W]
R76  220K  R-EU_R0805W  [R0805W]
R77  1K  R-EU_R0805W  [R0805W]
R78  100R  R-EU_R0805W  [R0805W]
R79  137R  R-EU_R0805W  [R0805W]
R81  1K  R-EU_R0805W  [R0805W]
R82  137R  R-EU_R0805W  [R0805W]
R83  100R  R-EU_R0805W  [R0805W]
R84  1K  R-EU_R0805W  [R0805W]
R85  1K  R-EU_R0805W  [R0805W]
R88  100R  R-EU_R0805W  [R0805W]
U$419  TESTPAD  [TESTPAD]
U$420  TESTPAD  [TESTPAD]
U$421  TESTPAD  [TESTPAD]
U$422  TESTPAD  [TESTPAD]
U$436  TESTPAD  [TESTPAD]
U$437  TESTPAD  [TESTPAD]
U$438  TESTPAD  [TESTPAD]
U$439  TESTPAD  [TESTPAD]
U$440  TESTPAD  [TESTPAD]
U$442  TESTPAD  [TESTPAD]
U$443  TESTPAD  [TESTPAD]
U$444  TESTPAD  [TESTPAD]
U$445  TESTPAD  [TESTPAD]
U$446  TESTPAD  [TESTPAD]
U$450  TESTPAD  [TESTPAD]
U$451  TESTPAD  [TESTPAD]
U$452  TESTPAD  [TESTPAD]
U$455  TESTPAD  [TESTPAD]
U$456  TESTPAD  [TESTPAD]
U$460  TESTPAD  [TESTPAD]
U$461  TESTPAD  [TESTPAD]
U$463  TESTPAD  [TESTPAD]
U$464  TESTPAD  [TESTPAD]
U$465  TESTPAD  [TESTPAD]
U$466  TESTPAD  [TESTPAD]
U$467  TESTPAD  [TESTPAD]
U$468  TESTPAD  [TESTPAD]
U$475  TESTPAD  [TESTPAD]
U$477  TESTPAD  [TESTPAD]
U$478  TESTPAD  [TESTPAD]
U$557  TESTPAD  [TESTPAD]
U$558  TESTPAD  [TESTPAD]
U$559  TESTPAD  [TESTPAD]
U$560  TESTPAD  [TESTPAD]
U$561  TESTPAD  [TESTPAD]

### Nets
0V: C17.2 C18.1 IC10.12(D:+IN) Q10.2(S) Q14.2(S) R40.2 R56.1 R73.2 R75.1 R76.1 R84.2 ; supply symbol labelled Z0L ; also sheet 2,3,4,5,6,7,8,10,11,12,13,14,15,16
+5V: C18.2 IC10.4(P:V+) ; also sheet 4,6
+24S: D18.3(C) D23.3(C) K5.1(R:+) K6.1(R:+) ; supply symbol labelled Z24S ; also sheet 3,6,8,11
-5V: C17.1 IC10.11(P:V-) ; also sheet 4,6
N$1: IC10.13(D:-IN) IC10.14(D:OUT) U$460.1
N$29: R71.2 R78.2 R84.1 U$439.1
N$31: IC10.6(B:-IN) R70.1 R77.2 U$419.1
N$32: C30.2 K5.6(T:P) R77.1 R78.1
N$33: D18.1(A) K5.8(R:-) Q10.3(D) U$446.1
N$37: IC10.5(B:+IN) R69.1 R76.2 U$442.1
N$39: C30.1 R69.2 R71.1 R72.2 U$440.1
N$41: K5.5(T:S) R79.2 U$438.1
N$49: R66.2 R73.1 R88.2 U$451.1
N$50: IC10.2(A:-IN) R67.1 R74.2 U$559.1
N$51: C36.2 K6.6(T:P) R66.1 R74.1 U$465.1
N$52: D23.1(A) K6.8(R:-) Q14.3(D) U$445.1
N$53: IC10.3(A:+IN) R68.1 R75.2 U$560.1
N$57: C36.1 R68.2 R83.2 R88.1 U$477.1
N$59: K6.5(T:S) R82.2 U$478.1
N$85: R38.2 R40.1 R54.2 U$467.1
N$86: IC10.9(C:-IN) R41.2 R57.1 U$463.1
N$90: IC10.10(C:+IN) R55.1 R56.2 U$464.1
N$91: C10.1 R38.1 R39.2 R55.2 U$466.1
N$122: K5.4(S:S) U$422.1
N$127: K5.2(S:O) U$420.1
N$129: K5.3(S:P) U$421.1
N$130: K6.4(S:S) U$456.1
N$323: K6.2(S:O) U$452.1
N$324: K6.3(S:P) U$455.1
PROD_TEMP_A: R72.1 R79.1 R85.2 U$436.1 ; also sheet 11
PROD_TEMP_B: K5.7(T:O) U$437.1 ; also sheet 11
PROD_TEMP_SIM_EN: Q10.1(G) U$450.1 ; also sheet 2
PRODUCT_TEMP: IC10.7(B:OUT) R70.2 U$443.1 ; also sheet 2
REF: R31.1 R81.1 R85.1 ; also sheet 2,6
REJECT_TEMP: IC10.1(A:OUT) R67.2 U$561.1 ; also sheet 2
REJECT_TEMP_A: R81.2 R82.1 R83.1 U$558.1 ; also sheet 11
REJECT_TEMP_B: K6.7(T:O) U$557.1 ; also sheet 11
REJECT_TEMP_SIM_EN: Q14.1(G) U$444.1 ; also sheet 2
RETURN_TEMP: IC10.8(C:OUT) R57.2 U$461.1 ; also sheet 2
RETURN_TEMP_A: R31.2 R39.1 U$475.1 ; also sheet 11
RETURN_TEMP_B: C10.2 R41.1 R54.1 U$468.1 ; also sheet 11

### Notes on the sheet
- Product temp | Reject temp
- To page 3 | To page 3
- 37-209-43
- To page 2 | To page 2
- Return temp
- To page 3
- Temperature
- Close to op-amp
- 1.1

## Sheet 10 of 16
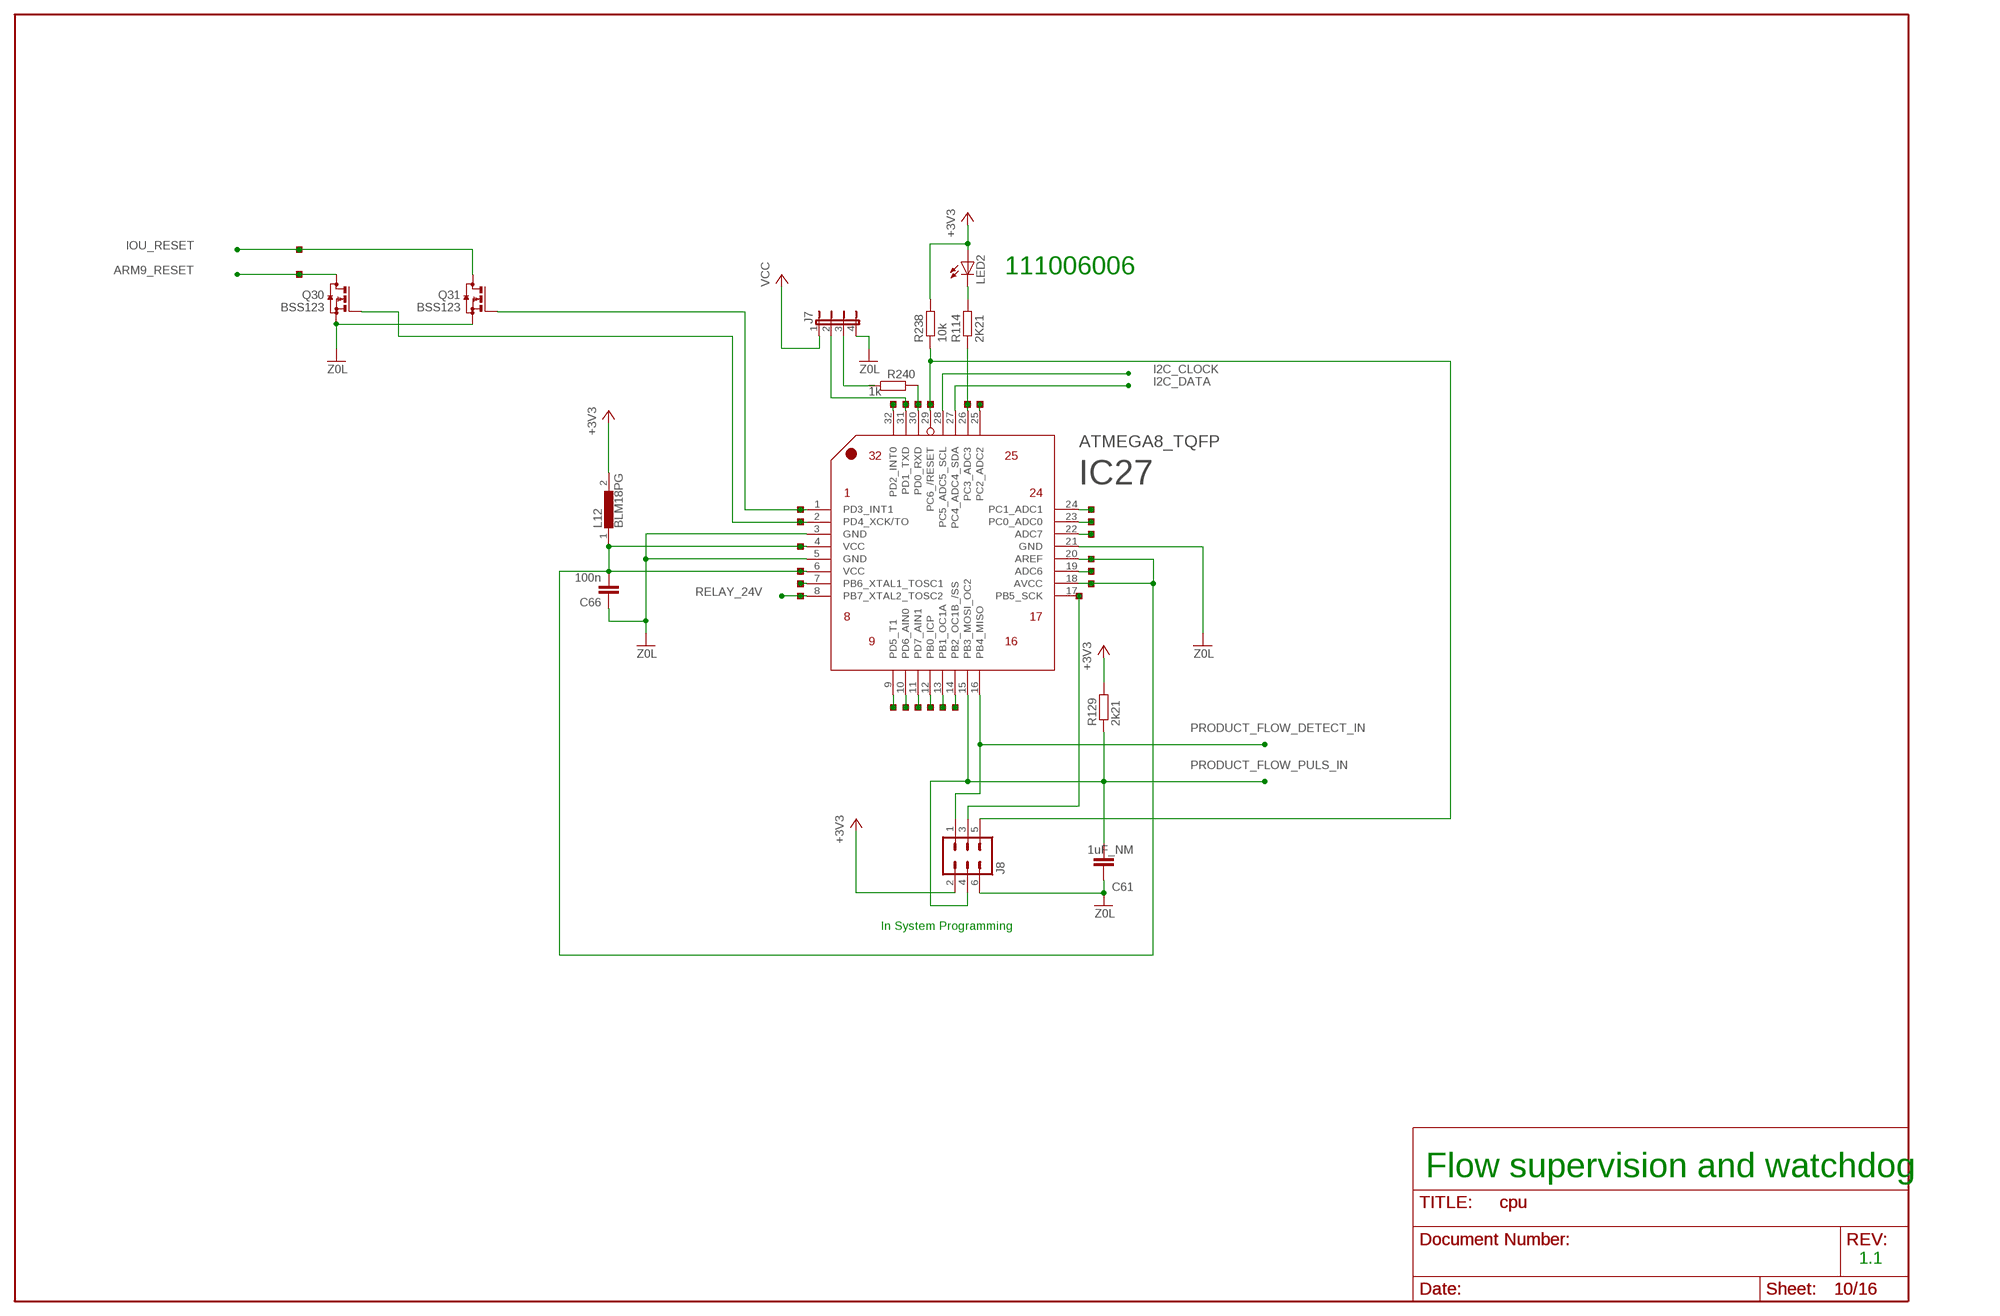
[diagram p10: schematic, sheet 10]

### Parts
C61  1uF_NM  C-EUC0805K  [C0805K]
C66  100n  C-EUC0805K  [C0805K]
IC27  ATMEGA8_TQFP  [TQFP-32]
J7  JP4E  [JP4]
J8  MA03-2  [MA03-2]
L12  BLM18PG  L1210  [L-0603]
LED2  LEDCHIPLED_1206  [CHIPLED_1206]
Q30  BSS123  [SOT23]
Q31  BSS123  [SOT23]
R114  2K21  R-EU_R0805W  [R0805W]
R129  2k21  R-EU_R0805W  [R0805W]
R238  10k  R-EU_R0805W  [R0805W]
R240  1k  R-EU_R0805W  [R0805W]
U$479  TESTPAD  [TESTPAD]
U$480  TESTPAD  [TESTPAD]
U$484  TESTPAD  [TESTPAD]
U$485  TESTPAD  [TESTPAD]
U$491  TESTPAD  [TESTPAD]
U$492  TESTPAD  [TESTPAD]
U$494  TESTPAD  [TESTPAD]
U$496  TESTPAD  [TESTPAD]
U$497  TESTPAD  [TESTPAD]
U$509  TESTPAD  [TESTPAD]
U$511  TESTPAD  [TESTPAD]
U$512  TESTPAD  [TESTPAD]
U$513  TESTPAD  [TESTPAD]
U$514  TESTPAD  [TESTPAD]
U$515  TESTPAD  [TESTPAD]
U$516  TESTPAD  [TESTPAD]
U$517  TESTPAD  [TESTPAD]
U$518  TESTPAD  [TESTPAD]
U$519  TESTPAD  [TESTPAD]
U$520  TESTPAD  [TESTPAD]
U$521  TESTPAD  [TESTPAD]
U$522  TESTPAD  [TESTPAD]
U$523  TESTPAD  [TESTPAD]
U$525  TESTPAD  [TESTPAD]
U$526  TESTPAD  [TESTPAD]
U$531  TESTPAD  [TESTPAD]
U$532  TESTPAD  [TESTPAD]

### Nets
0V: C61.1 C66.1 IC27.3(GND) IC27.5(GND) IC27.21(GND) J7.4 J8.6 Q30.2(S) Q31.2(S) ; supply symbol labelled Z0L ; also sheet 2,3,4,5,6,7,8,9,11,12,13,14,15,16
+3V3: J8.2 L12.2 LED2.A R129.2 R238.2 ; also sheet 2,3,4,5,6,7,11,12,13,14,15,16
ARM9_RESET: Q30.3(D) U$480.1 ; also sheet 14
I2C_CLOCK: IC27.28(PC5_ADC5_SCL) ; also sheet 2,3,5
I2C_DATA: IC27.27(PC4_ADC4_SDA) ; also sheet 2,3,5
IOU_RESET: Q31.3(D) U$479.1 ; also sheet 2
N$2: IC27.26(PC3_ADC3) R114.1 U$513.1
N$3: IC27.17(PB5_SCK) J8.3 U$532.1
N$4: C66.2 IC27.4(VCC) IC27.6(VCC) IC27.18(AVCC) IC27.20(AREF) L12.1 U$494.1 U$496.1 U$525.1 U$531.1
N$5: LED2.C R114.2
N$13: IC27.29(PC6_/RESET) J8.5 R238.1 U$512.1
N$108: J7.3
N$109: IC27.31(PD1_TXD) J7.2 U$509.1
N$133: IC27.1(PD3_INT1) Q31.1(G) U$484.1
N$141: IC27.2(PD4_XCK/TO) Q30.1(G) U$485.1
N$325: IC27.24(PC1_ADC1) U$515.1
N$326: IC27.23(PC0_ADC0) U$516.1
N$327: IC27.22(ADC7) U$523.1
N$328: IC27.19(ADC6) U$526.1
N$329: IC27.9(PD5_T1) U$517.1
N$330: IC27.10(PD6_AIN0) U$518.1
N$331: IC27.11(PD7_AIN1) U$519.1
N$332: IC27.12(PB0_ICP) U$520.1
N$333: IC27.13(PB1_OC1A) U$521.1
N$334: IC27.14(PB2_OC1B_/SS) U$522.1
N$335: IC27.7(PB6_XTAL1_TOSC1) U$492.1
N$336: IC27.32(PD2_INT0) U$497.1
N$337: IC27.25(PC2_ADC2) U$514.1
N$382: IC27.30(PD0_RXD) R240.2 U$511.1
PRODUCT_FLOW_DETECT_IN: IC27.16(PB4_MISO) J8.1 ; also sheet 3
PRODUCT_FLOW_PULS_IN: C61.2 IC27.15(PB3_MOSI_OC2) J8.4 R129.1 ; also sheet 11
RELAY_24V: IC27.8(PB7_XTAL2_TOSC2) U$491.1 ; also sheet 6
VCC: J7.1 ; also sheet 2,3,6,7,11
Unconnected: R240.1

### Notes on the sheet
- 111006006
- In System Programming
- Flow supervision and watchdog
- 1.1

## Sheet 11 of 16
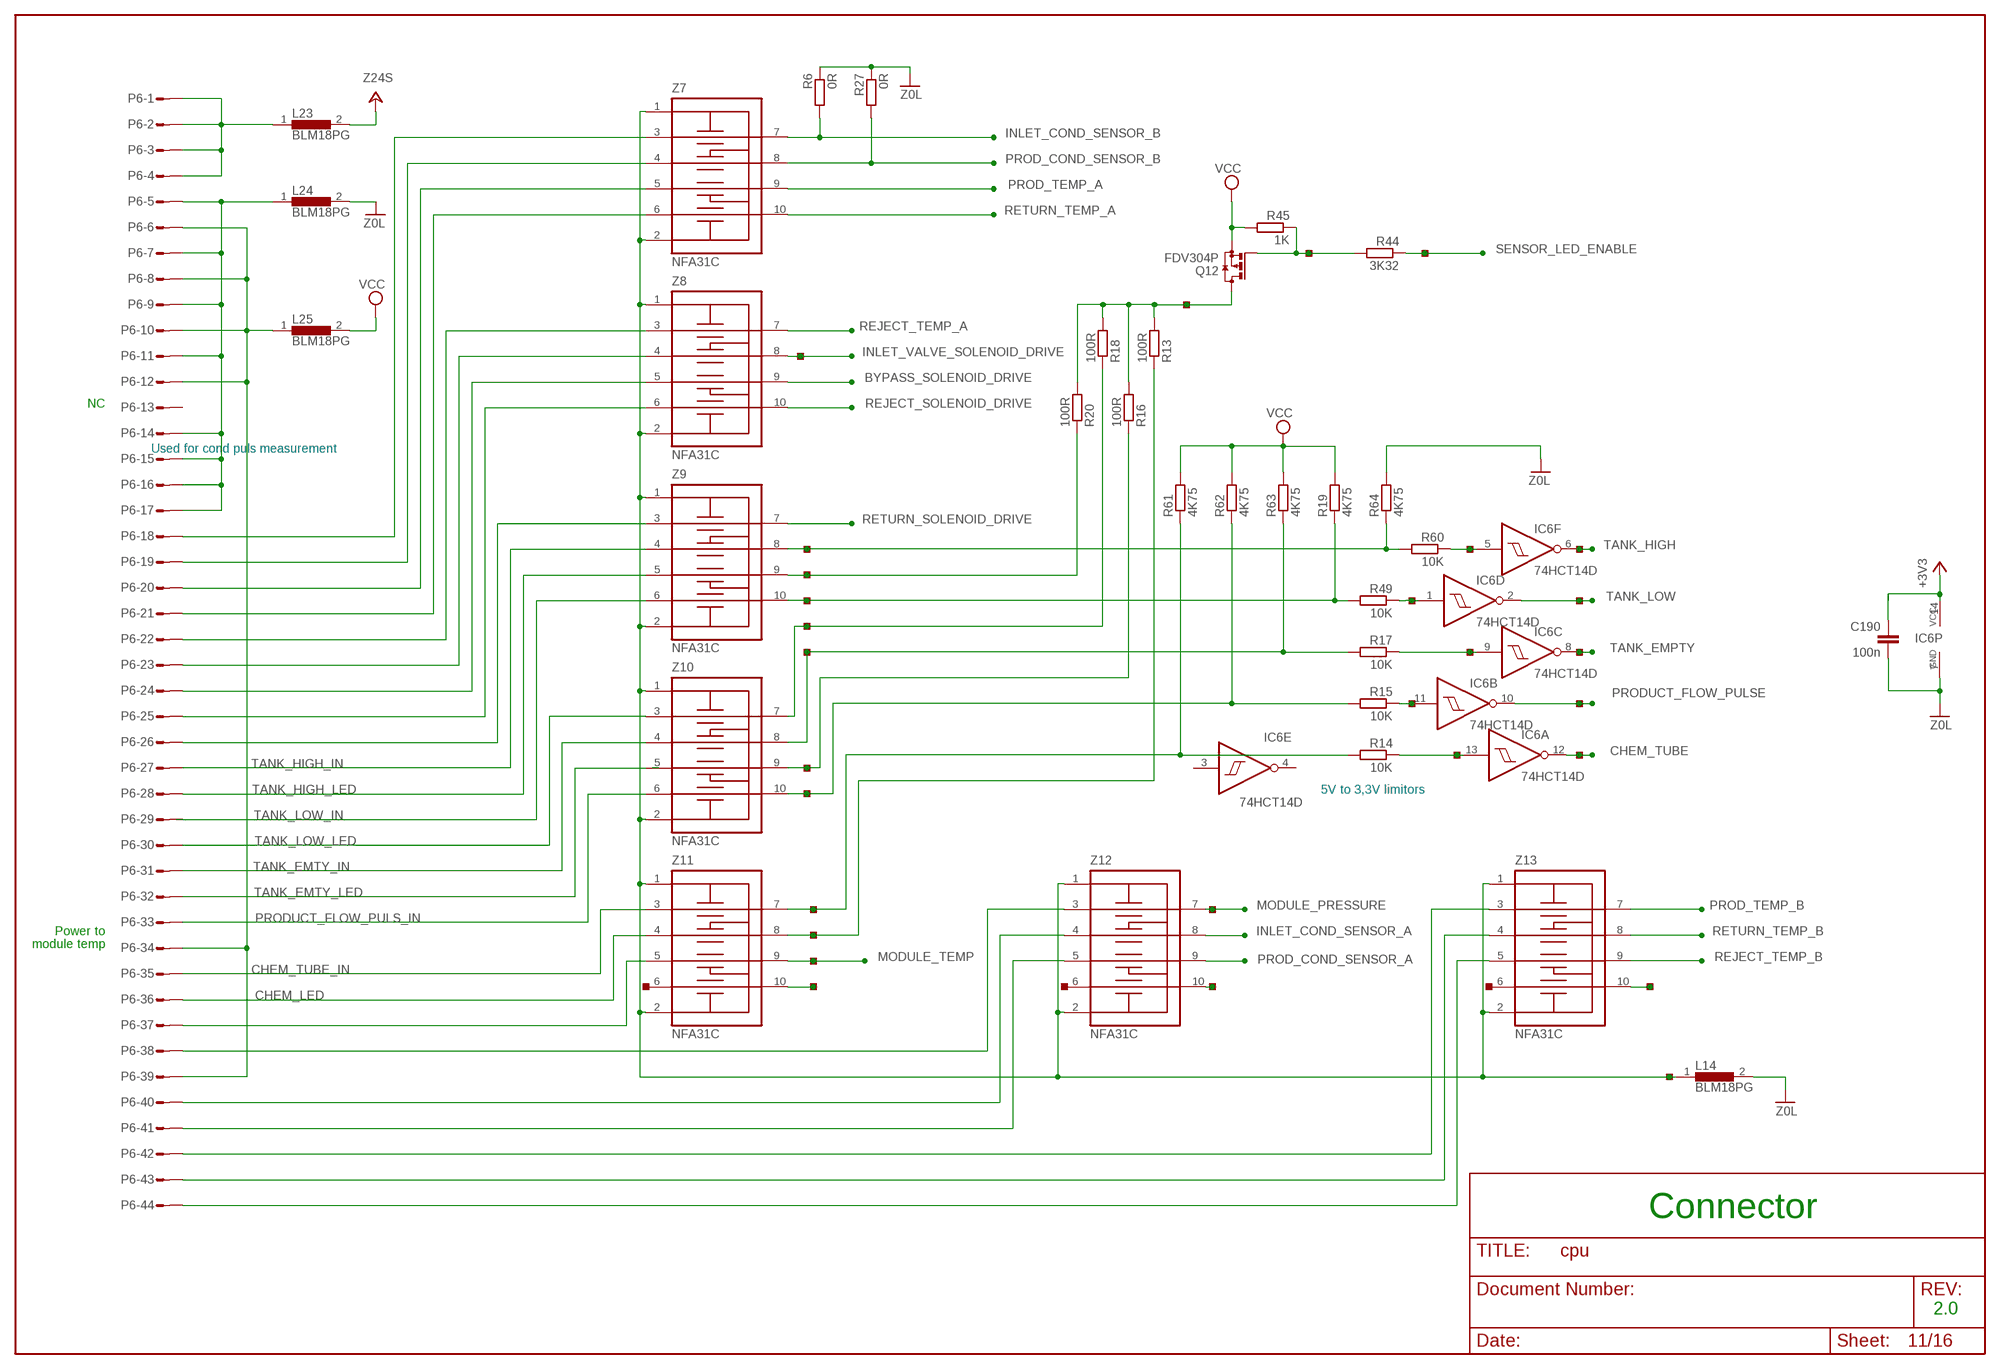
[diagram p11: schematic, sheet 11]

### Parts
C190  100n  C-EUC0805K  [C0805K]
L14  BLM18PG  [L-0603]
L23  BLM18PG  [L-0603]
L24  BLM18PG  [L-0603]
L25  BLM18PG  [L-0603]
P6  MODU44  [MODU44]
Q12  FDV304P  BSS84  [SOT23]
R6  0R  R-EU_R0805W  [R0805W]
R13  100R  R-EU_R0805W  [R0805W]
R14  10K  R-EU_R0805W  [R0805W]
R15  10K  R-EU_R0805W  [R0805W]
R16  100R  R-EU_R0805W  [R0805W]
R17  10K  R-EU_R0805W  [R0805W]
R18  100R  R-EU_R0805W  [R0805W]
R19  4K75  R-EU_R0805W  [R0805W]
R20  100R  R-EU_R0805W  [R0805W]
R27  0R  R-EU_R0805W  [R0805W]
R44  3K32  R-EU_R0805W  [R0805W]
R45  1K  R-EU_R0805W  [R0805W]
R49  10K  R-EU_R0805W  [R0805W]
R60  10K  R-EU_R0805W  [R0805W]
R61  4K75  R-EU_R0805W  [R0805W]
R62  4K75  R-EU_R0805W  [R0805W]
R63  4K75  R-EU_R0805W  [R0805W]
R64  4K75  R-EU_R0805W  [R0805W]
U$92  TESTPAD  [TESTPAD]
U$99  TESTPAD  [TESTPAD]
U$101  TESTPAD  [TESTPAD]
U$301  TESTPAD  [TESTPAD]
U$302  TESTPAD  [TESTPAD]
U$533  TESTPAD  [TESTPAD]
U$534  TESTPAD  [TESTPAD]
U$535  TESTPAD  [TESTPAD]
U$536  TESTPAD  [TESTPAD]
U$537  TESTPAD  [TESTPAD]
U$538  TESTPAD  [TESTPAD]
U$539  TESTPAD  [TESTPAD]
U$540  TESTPAD  [TESTPAD]
U$562  TESTPAD  [TESTPAD]
U$563  TESTPAD  [TESTPAD]
U$564  TESTPAD  [TESTPAD]
U$565  TESTPAD  [TESTPAD]
U$566  TESTPAD  [TESTPAD]
U$567  TESTPAD  [TESTPAD]
U$568  TESTPAD  [TESTPAD]
U$576  TESTPAD  [TESTPAD]
U$577  TESTPAD  [TESTPAD]
U$578  TESTPAD  [TESTPAD]
U$579  TESTPAD  [TESTPAD]
U$580  TESTPAD  [TESTPAD]
U$581  TESTPAD  [TESTPAD]
U$582  TESTPAD  [TESTPAD]
U$583  TESTPAD  [TESTPAD]
U$584  TESTPAD  [TESTPAD]
U$585  TESTPAD  [TESTPAD]
U$586  TESTPAD  [TESTPAD]
U$587  TESTPAD  [TESTPAD]
Z7  NFA31C  EMI_FILTER_22PF/200-MA  [EMI_FILTER_1206]
Z8  NFA31C  EMI_FILTER_22PF/200-MA  [EMI_FILTER_1206]
Z9  NFA31C  EMI_FILTER_22PF/200-MA  [EMI_FILTER_1206]
Z10  NFA31C  EMI_FILTER_22PF/200-MA  [EMI_FILTER_1206]
Z11  NFA31C  EMI_FILTER_22PF/200-MA  [EMI_FILTER_1206]
Z12  NFA31C  EMI_FILTER_22PF/200-MA  [EMI_FILTER_1206]
Z13  NFA31C  EMI_FILTER_22PF/200-MA  [EMI_FILTER_1206]

### Nets
0V: C190.1 IC6.7(P:GND) L14.2 L24.2 R6.1 R27.1 R64.2 ; supply symbol labelled Z0L ; also sheet 2,3,4,5,6,7,8,9,10,12,13,14,15,16
+3V3: C190.2 IC6.14(P:VCC) ; also sheet 2,3,4,5,6,7,10,12,13,14,15,16
+24S: L23.2 ; supply symbol labelled Z24S ; also sheet 3,6,8,9
BYPASS_SOLENOID_DRIVE: P6.P$24 Z8.5 Z8.9 ; also sheet 8
CHEM_LED: P6.P$36 Z11.4
CHEM_TUBE: IC6.12(A:O) U$578.1 ; also sheet 5
CHEM_TUBE_IN: P6.P$35 R14.2 R61.1 U$562.1 Z11.3 Z11.7
INLET_COND_SENSOR_A: Z12.8 ; also sheet 4
INLET_COND_SENSOR_B: P6.P$18 R6.2 Z7.3 Z7.7
INLET_VALVE_SOLENOID_DRIVE: P6.P$23 U$92.1 Z8.4 Z8.8 ; also sheet 8
MODULE_PRESSURE: P6.P$38 U$576.1 Z12.3 Z12.7 ; also sheet 2
MODULE_TEMP: U$539.1 Z11.9 ; also sheet 2
N$135: L23.1 P6.P$1 P6.P$2 P6.P$3 P6.P$4
N$140: L24.1 P6.P$5 P6.P$7 P6.P$9 P6.P$11 P6.P$14 P6.P$15 P6.P$16 P6.P$17
N$142: L25.1 P6.P$6 P6.P$8 P6.P$10 P6.P$12 P6.P$34 P6.P$39
N$219: Q12.1(G) R44.2 R45.1 U$302.1
N$222: Q12.3(D) R13.2 R16.2 R18.2 R20.2 U$101.1
N$223: IC6.5(F:I) R60.1 U$587.1
N$224: IC6.1(D:I) R49.1 U$586.1
N$225: IC6.9(C:I) R17.1 U$585.1
N$226: IC6.11(B:I) R15.1 U$584.1
N$227: IC6.13(A:I) R14.1 U$583.1
N$228: R20.1 U$536.1 Z9.9
N$229: R13.1 U$540.1 Z11.8
N$231: P6.P$37 Z11.5
N$232: L14.1 U$565.1 Z7.1 Z7.2 Z8.1 Z8.2 Z9.1 Z9.2 Z10.1 Z10.2 Z11.1 Z11.2 Z12.1 Z12.2 Z13.1 Z13.2
N$233: P6.P$40 Z12.4
N$234: P6.P$41 Z12.5
N$235: P6.P$44 Z13.5
N$236: P6.P$42 Z13.3
N$238: P6.P$43 Z13.4
N$340: U$538.1 Z11.10
N$342: U$568.1 Z12.10
N$343: U$566.1 Z13.10
N$378: U$99.1 Z11.6
N$379: U$567.1 Z13.6
N$380: U$577.1 Z12.6
PROD_COND_SENSOR_A: Z12.9 ; also sheet 4
PROD_COND_SENSOR_B: P6.P$19 R27.2 Z7.4 Z7.8
PROD_TEMP_A: P6.P$20 Z7.5 Z7.9 ; also sheet 9
PROD_TEMP_B: Z13.7 ; also sheet 9
PRODUCT_FLOW_PULS_IN: P6.P$33 R15.2 R62.1 U$563.1 Z10.6 Z10.10 ; also sheet 10
PRODUCT_FLOW_PULSE: IC6.10(B:O) U$579.1 ; also sheet 4
REJECT_SOLENOID_DRIVE: P6.P$25 Z8.6 Z8.10 ; also sheet 8
REJECT_TEMP_A: P6.P$22 Z8.3 Z8.7 ; also sheet 9
REJECT_TEMP_B: Z13.9 ; also sheet 9
RETURN_SOLENOID_DRIVE: P6.P$26 Z9.3 Z9.7 ; also sheet 8
RETURN_TEMP_A: P6.P$21 Z7.6 Z7.10 ; also sheet 9
RETURN_TEMP_B: Z13.8 ; also sheet 9
SENSOR_LED_ENABLE: R44.1 U$301.1 ; also sheet 5
TANK_EMPTY: IC6.8(C:O) U$580.1 ; also sheet 5
TANK_EMPTY_IN2: R17.2 R63.1 U$533.1 Z10.8
TANK_EMPTY_LED1: R16.1 U$564.1 Z10.9
TANK_EMTY_IN: P6.P$31 Z10.4
TANK_EMTY_LED: P6.P$32 Z10.5
TANK_HIGH: IC6.6(F:O) U$582.1 ; also sheet 5
TANK_HIGH_IN: P6.P$27 R60.2 R64.1 U$537.1 Z9.4 Z9.8
TANK_HIGH_LED: P6.P$28 Z9.5
TANK_LOW: IC6.2(D:O) U$581.1 ; also sheet 5
TANK_LOW_IN: P6.P$29 R19.1 R49.2 U$535.1 Z9.6 Z9.10
TANK_LOW_LED: P6.P$30 R18.1 U$534.1 Z10.3 Z10.7
VCC: L25.2 Q12.2(S) R19.2 R45.2 R61.2 R62.2 R63.2 ; also sheet 2,3,6,7,10
Unconnected: P6.P$13

### Notes on the sheet
- NC
- Used for cond puls measurement
- 5V to 3,3V limitors
- Power to
- module temp
- Connector
- 2.0